# EAGLE design RPBv2 (EAGLE 6.5.0)

## Sheet 1 of 3
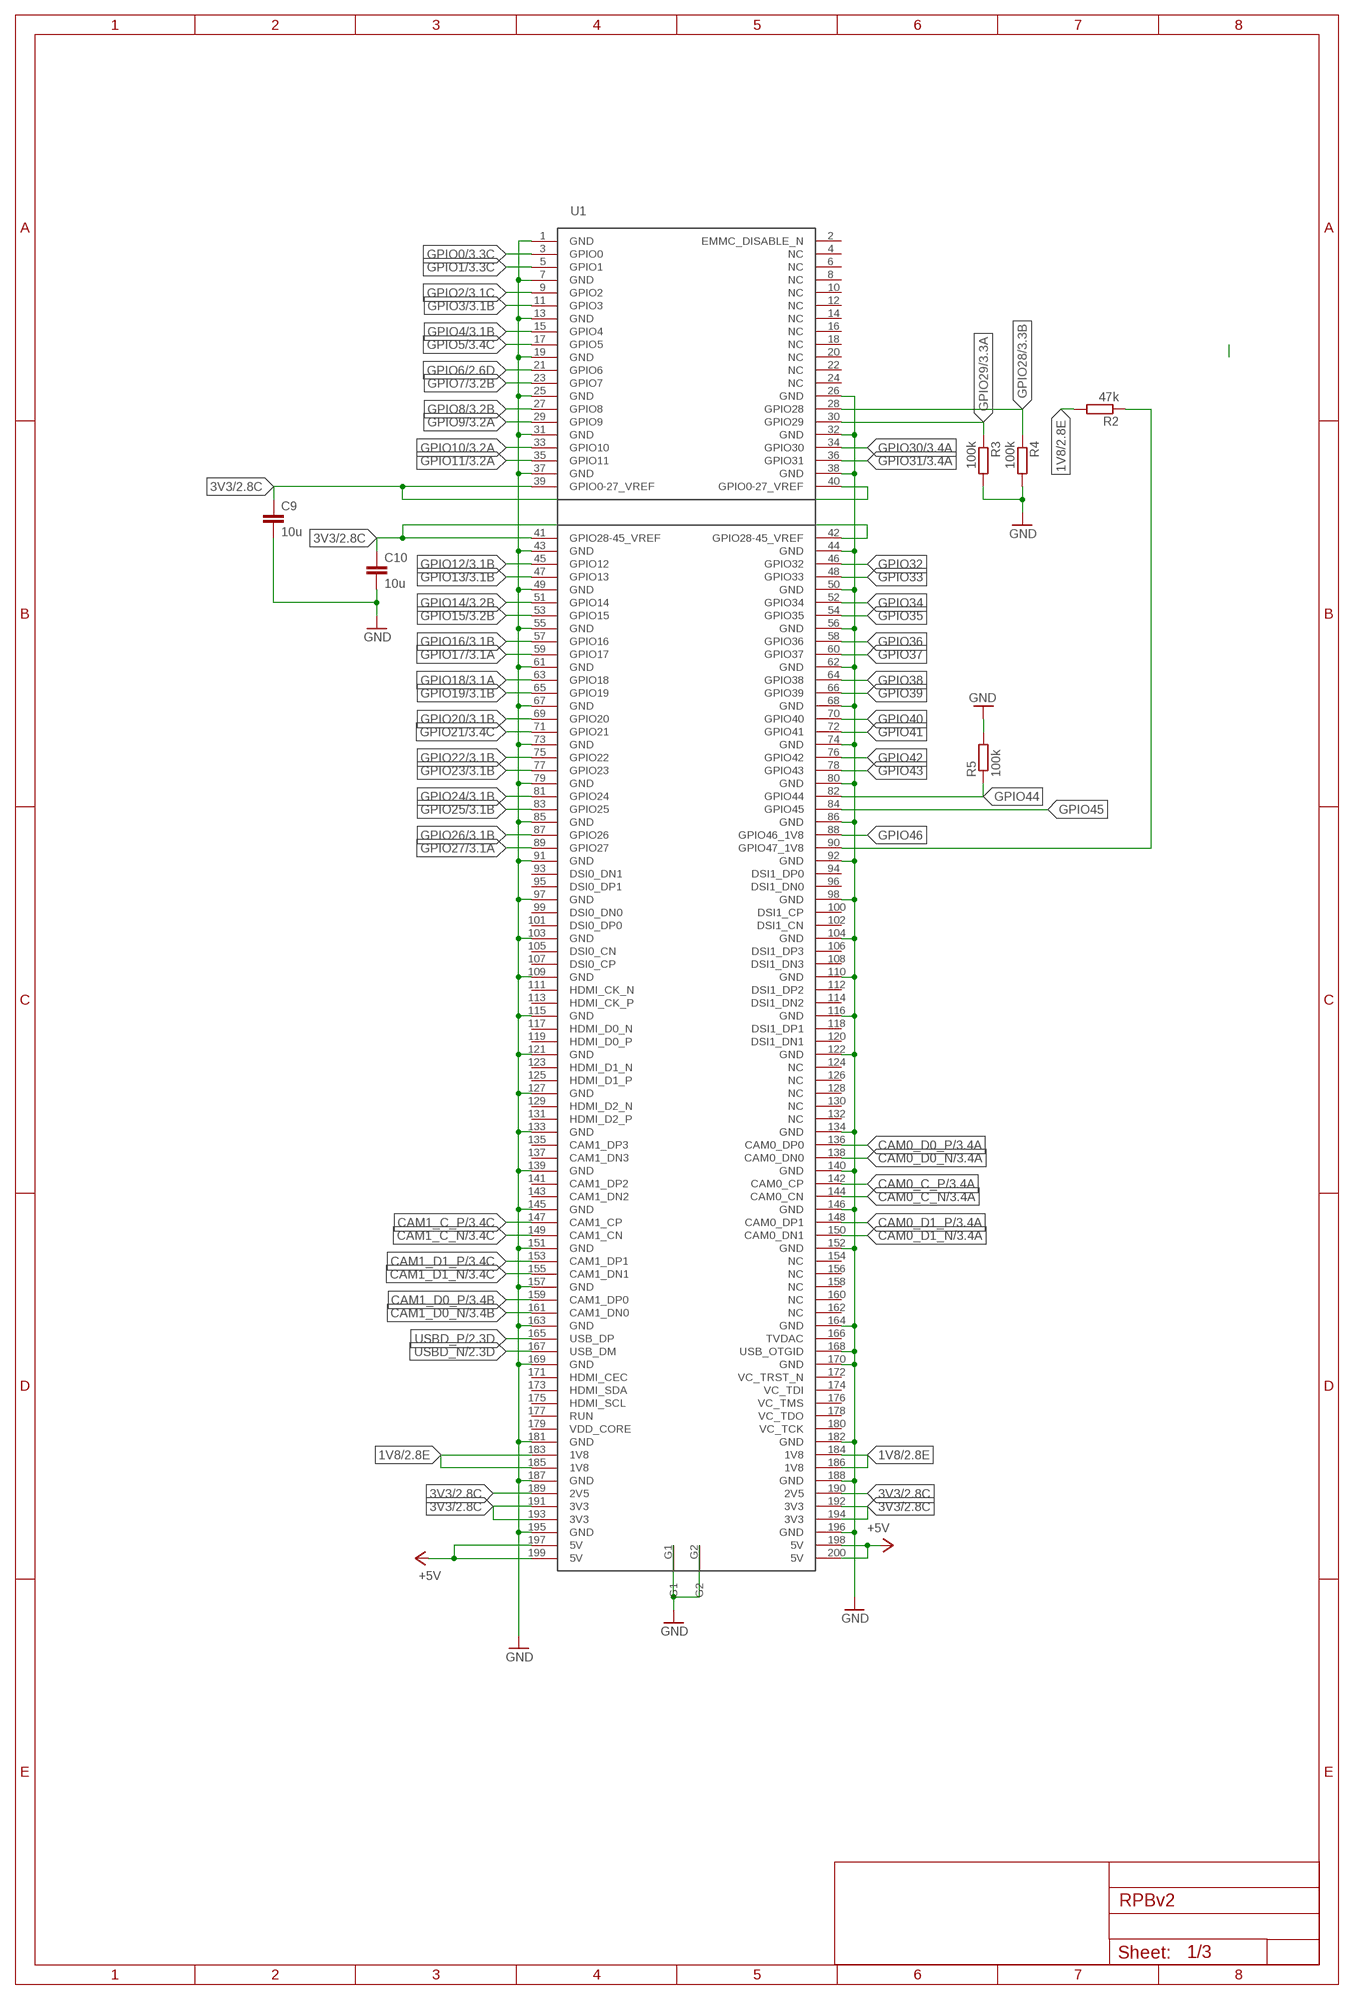
[diagram p0: schematic, sheet 1]

### Parts
C9  10u  C-EUC0805  [C0805]
C10  10u  C-EUC0805  [C0805]
R2  47k  R-EU_R0603  [R0603]
R3  100k  R-EU_R0603  [R0603]
R4  100k  R-EU_R0603  [R0603]
R5  100k  R-EU_R0603  [R0603]
U1  RASPI  [SO-DIMM]

### Nets
1V8: R2.2 U1.183(1V8) U1.184(1V8) U1.185(1V8) U1.186(1V8) ; also sheet 2
3V3: C9.1 C10.1 U1.39(GPIO0-27_VREF) U1.40(GPIO0-27_VREF) U1.41(GPIO28-45_VREF) U1.42(GPIO28-45_VREF) U1.189(2V5) U1.190(2V5) U1.191(3V3) U1.192(3V3) U1.193(3V3) U1.194(3V3) ; also sheet 2,3
+5V: U1.197(5V) U1.198(5V) U1.199(5V) U1.200(5V) ; also sheet 2,3
CAM0_C_N: U1.144(CAM0_CN) ; also sheet 3
CAM0_C_P: U1.142(CAM0_CP) ; also sheet 3
CAM0_D0_N: U1.138(CAM0_DN0) ; also sheet 3
CAM0_D0_P: U1.136(CAM0_DP0) ; also sheet 3
CAM0_D1_N: U1.150(CAM0_DN1) ; also sheet 3
CAM0_D1_P: U1.148(CAM0_DP1) ; also sheet 3
CAM1_C_N: U1.149(CAM1_CN) ; also sheet 3
CAM1_C_P: U1.147(CAM1_CP) ; also sheet 3
CAM1_D0_N: U1.161(CAM1_DN0) ; also sheet 3
CAM1_D0_P: U1.159(CAM1_DP0) ; also sheet 3
CAM1_D1_N: U1.155(CAM1_DN1) ; also sheet 3
CAM1_D1_P: U1.153(CAM1_DP1) ; also sheet 3
GND: C9.2 C10.2 R3.2 R4.2 R5.2 U1.1(GND) U1.7(GND) U1.13(GND) U1.19(GND) U1.25(GND) U1.26(GND) U1.31(GND) U1.32(GND) U1.37(GND) U1.38(GND) U1.43(GND) U1.44(GND) U1.49(GND) U1.50(GND) U1.55(GND) U1.56(GND) U1.61(GND) U1.62(GND) U1.67(GND) U1.68(GND) U1.73(GND) U1.74(GND) U1.79(GND) U1.80(GND) U1.85(GND) U1.86(GND) U1.91(GND) U1.92(GND) U1.97(GND) U1.98(GND) U1.103(GND) U1.104(GND) U1.109(GND) U1.110(GND) U1.115(GND) U1.116(GND) U1.121(GND) U1.122(GND) U1.127(GND) U1.133(GND) U1.134(GND) U1.139(GND) U1.140(GND) U1.145(GND) U1.146(GND) U1.151(GND) U1.152(GND) U1.157(GND) U1.163(GND) U1.164(GND) U1.168(USB_OTGID) U1.169(GND) U1.170(GND) U1.181(GND) U1.182(GND) U1.187(GND) U1.188(GND) U1.195(GND) U1.196(GND) U1.G1 U1.G2 ; also sheet 2,3
GPIO0: U1.3(GPIO0) ; also sheet 3
GPIO1: U1.5(GPIO1) ; also sheet 3
GPIO2: U1.9(GPIO2) ; also sheet 3
GPIO3: U1.11(GPIO3) ; also sheet 3
GPIO4: U1.15(GPIO4) ; also sheet 3
GPIO5: U1.17(GPIO5) ; also sheet 3
GPIO6: U1.21(GPIO6) ; also sheet 2,3
GPIO7: U1.23(GPIO7) ; also sheet 3
GPIO8: U1.27(GPIO8) ; also sheet 3
GPIO9: U1.29(GPIO9) ; also sheet 3
GPIO10: U1.33(GPIO10) ; also sheet 3
GPIO11: U1.35(GPIO11) ; also sheet 3
GPIO12: U1.45(GPIO12) ; also sheet 3
GPIO13: U1.47(GPIO13) ; also sheet 3
GPIO14: U1.51(GPIO14) ; also sheet 3
GPIO15: U1.53(GPIO15) ; also sheet 3
GPIO16: U1.57(GPIO16) ; also sheet 3
GPIO17: U1.59(GPIO17) ; also sheet 3
GPIO18: U1.63(GPIO18) ; also sheet 3
GPIO19: U1.65(GPIO19) ; also sheet 3
GPIO20: U1.69(GPIO20) ; also sheet 3
GPIO21: U1.71(GPIO21) ; also sheet 3
GPIO22: U1.75(GPIO22) ; also sheet 3
GPIO23: U1.77(GPIO23) ; also sheet 3
GPIO24: U1.81(GPIO24) ; also sheet 3
GPIO25: U1.83(GPIO25) ; also sheet 3
GPIO26: U1.87(GPIO26) ; also sheet 3
GPIO27: U1.89(GPIO27) ; also sheet 3
GPIO28: R4.1 U1.28(GPIO28) ; also sheet 3
GPIO29: R3.1 U1.30(GPIO29) ; also sheet 3
GPIO30: U1.34(GPIO30) ; also sheet 3
GPIO31: U1.36(GPIO31) ; also sheet 3
GPIO32: U1.46(GPIO32)
GPIO33: U1.48(GPIO33)
GPIO34: U1.52(GPIO34)
GPIO35: U1.54(GPIO35)
GPIO36: U1.58(GPIO36)
GPIO37: U1.60(GPIO37)
GPIO38: U1.64(GPIO38)
GPIO39: U1.66(GPIO39)
GPIO40: U1.70(GPIO40)
GPIO41: U1.72(GPIO41)
GPIO42: U1.76(GPIO42)
GPIO43: U1.78(GPIO43)
GPIO44: R5.1 U1.82(GPIO44)
GPIO45: U1.84(GPIO45)
GPIO46: U1.88(GPIO46_1V8)
N$6: R2.1 U1.90(GPIO47_1V8)
USBD_N: U1.167(USB_DM) ; also sheet 2
USBD_P: U1.165(USB_DP) ; also sheet 2
Unconnected: U1.2(EMMC_DISABLE_N) U1.4(NC) U1.6(NC) U1.8(NC) U1.10(NC) U1.12(NC) U1.14(NC) U1.16(NC) U1.18(NC) U1.20(NC) U1.22(NC) U1.24(NC) U1.93(DSI0_DN1) U1.94(DSI1_DP0) U1.95(DSI0_DP1) U1.96(DSI1_DN0) U1.99(DSI0_DN0) U1.100(DSI1_CP) U1.101(DSI0_DP0) U1.102(DSI1_CN) U1.105(DSI0_CN) U1.106(DSI1_DP3) U1.107(DSI0_CP) U1.108(DSI1_DN3) U1.111(HDMI_CK_N) U1.112(DSI1_DP2) U1.113(HDMI_CK_P) U1.114(DSI1_DN2) U1.117(HDMI_D0_N) U1.118(DSI1_DP1) U1.119(HDMI_D0_P) U1.120(DSI1_DN1) U1.123(HDMI_D1_N) U1.124(NC) U1.125(HDMI_D1_P) U1.126(NC) U1.128(NC) U1.129(HDMI_D2_N) U1.130(NC) U1.131(HDMI_D2_P) U1.132(NC) U1.135(CAM1_DP3) U1.137(CAM1_DN3) U1.141(CAM1_DP2) U1.143(CAM1_DN2) U1.154(NC) U1.156(NC) U1.158(NC) U1.160(NC) U1.162(NC) U1.166(TVDAC) U1.171(HDMI_CEC) U1.172(VC_TRST_N) U1.173(HDMI_SDA) U1.174(VC_TDI) U1.175(HDMI_SCL) U1.176(VC_TMS) U1.177(RUN) U1.178(VC_TDO) U1.179(VDD_CORE) U1.180(VC_TCK)

## Sheet 2 of 3
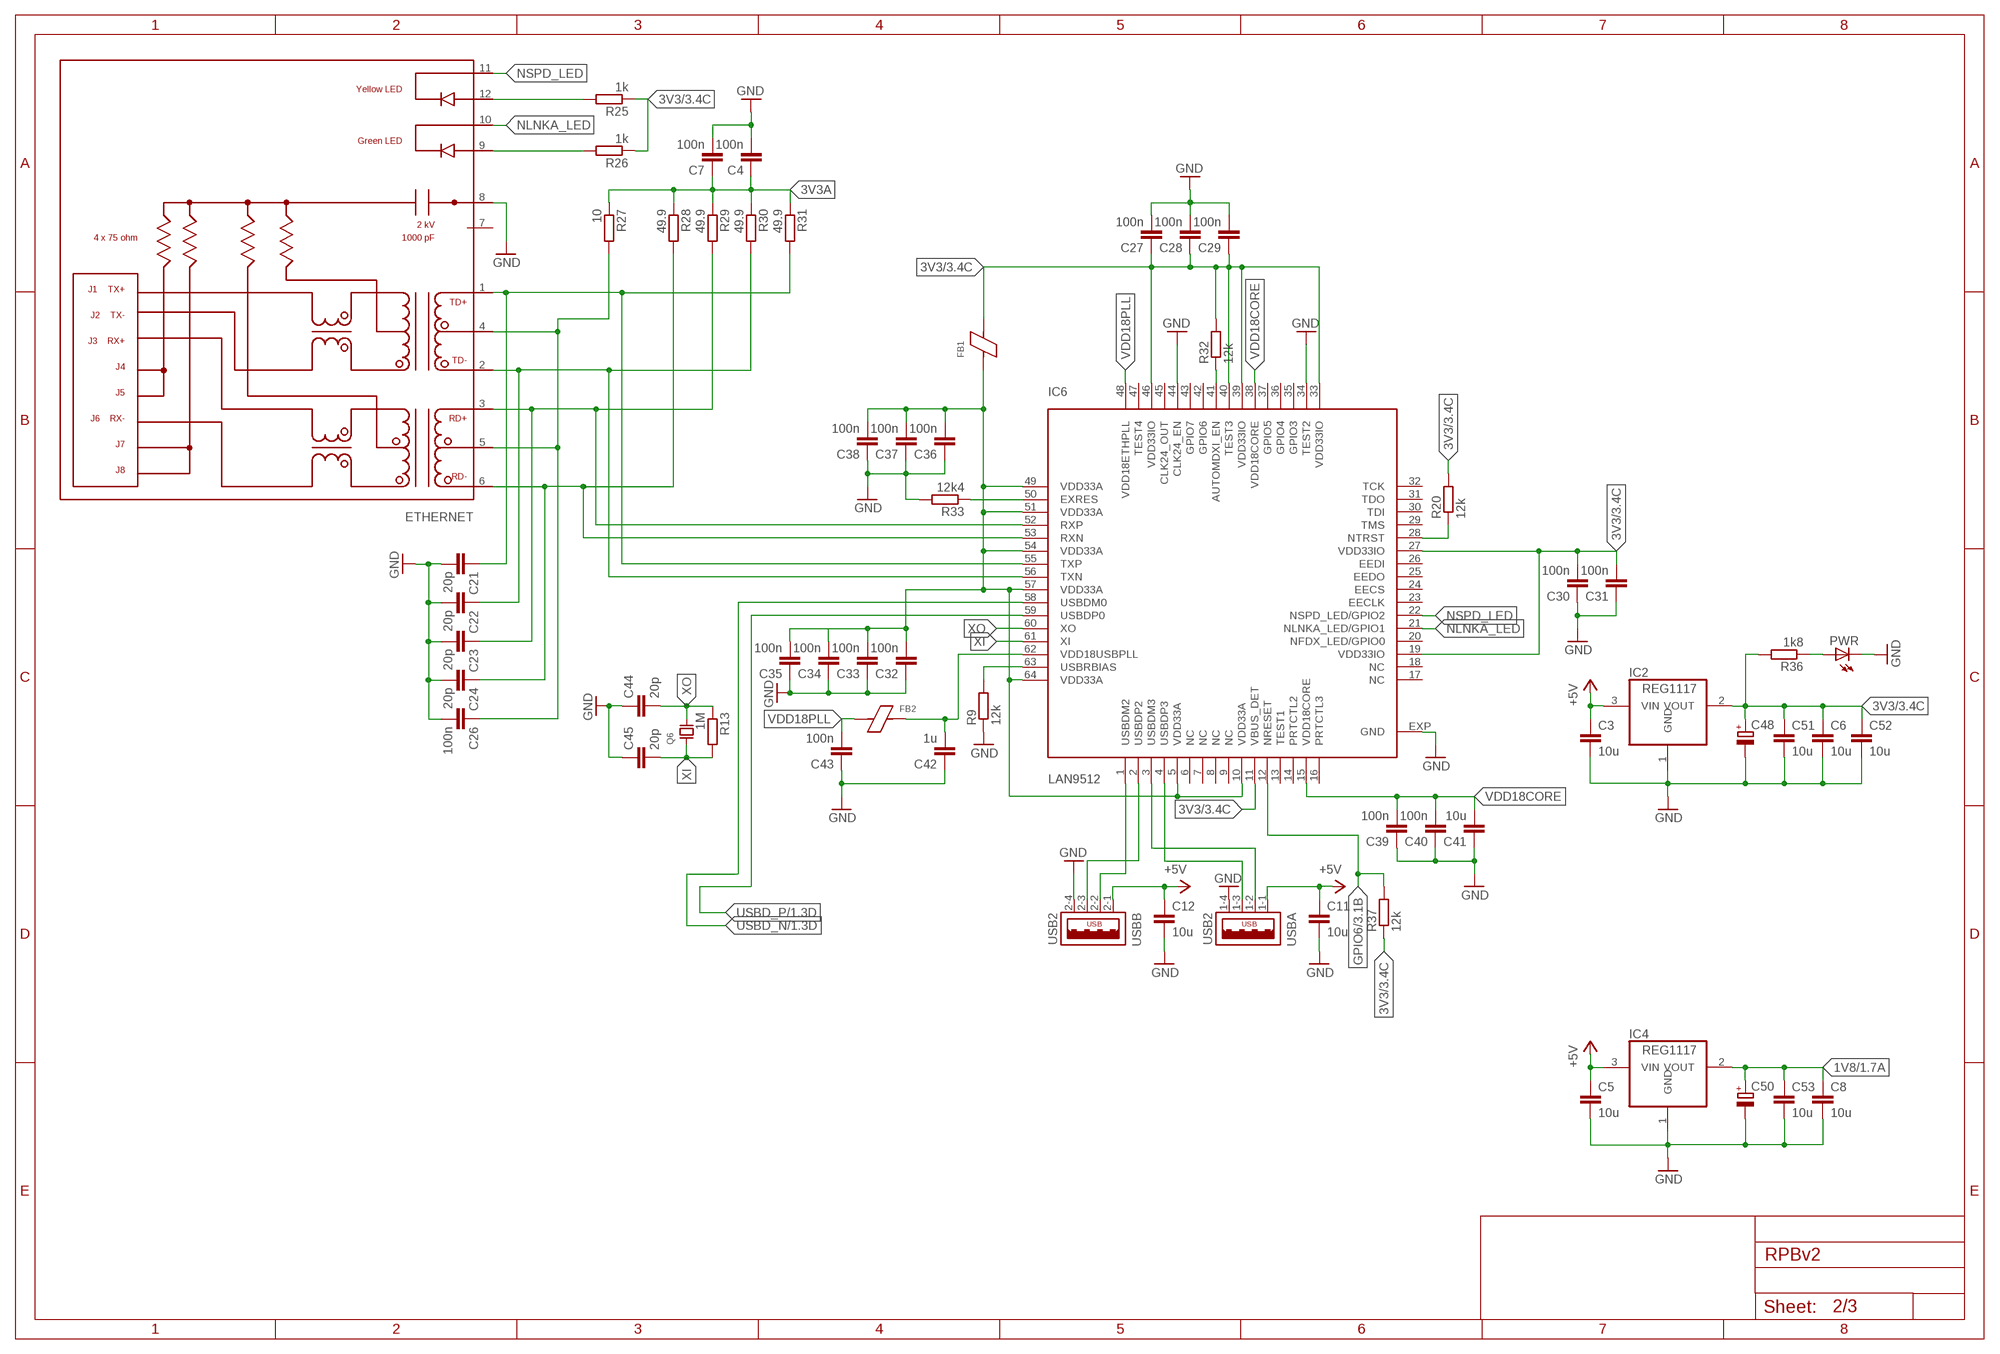
[diagram p1: schematic, sheet 2]

### Parts
C3  10u  C-EUC0805  [C0805]
C4  100n  C-EUC0603  [C0603]
C5  10u  C-EUC0805  [C0805]
C6  10u  C-EUC0805  [C0805]
C7  100n  C-EUC0603  [C0603]
C8  10u  C-EUC0805  [C0805]
C11  10u  C-EUC0805  [C0805]
C12  10u  C-EUC0805  [C0805]
C21  20p  C-EUC0603  [C0603]
C22  20p  C-EUC0603  [C0603]
C23  20p  C-EUC0603  [C0603]
C24  20p  C-EUC0603  [C0603]
C26  100n  C-EUC0603  [C0603]
C27  100n  C-EUC0603  [C0603]
C28  100n  C-EUC0603  [C0603]
C29  100n  C-EUC0603  [C0603]
C30  100n  C-EUC0603  [C0603]
C31  100n  C-EUC0603  [C0603]
C32  100n  C-EUC0603  [C0603]
C33  100n  C-EUC0603  [C0603]
C34  100n  C-EUC0603  [C0603]
C35  100n  C-EUC0603  [C0603]
C36  100n  C-EUC0603  [C0603]
C37  100n  C-EUC0603  [C0603]
C38  100n  C-EUC0603  [C0603]
C39  100n  C-EUC0603  [C0603]
C40  100n  C-EUC0603  [C0603]
C41  10u  C-EUC0805  [C0805]
C42  1u  C-EUC0805  [C0805]
C43  100n  C-EUC0603  [C0603]
C44  20p  C-EUC0603  [C0603]
C45  20p  C-EUC0603  [C0603]
C48  CPOL-EU153CLV-0605  [153CLV-0605]
C50  CPOL-EU153CLV-0605  [153CLV-0605]
C51  10u  C-EUC0805  [C0805]
C52  10u  C-EUC0805  [C0805]
C53  10u  C-EUC0805  [C0805]
ETHERNET  HR911105A  [RJ45]
FB1  FERRITE_BEAD  [C0805]
FB2  FERRITE_BEAD  [C0805]
IC2  REG1117  [SOT223]
IC4  REG1117  [SOT223]
IC6  LAN9512  [QFN64-9X9]
PWR  LEDCHIP-LED0603  [CHIP-LED0603]
Q6  CTS_32X25_SMD  [CTS_32X25]
R9  12k  R-EU_R0603  [R0603]
R13  1M  R-EU_R0603  [R0603]
R20  12k  R-EU_R0603  [R0603]
R25  1k  R-EU_R0603  [R0603]
R26  1k  R-EU_R0603  [R0603]
R27  10  R-EU_R0603  [R0603]
R28  49.9  R-EU_R0603  [R0603]
R29  49.9  R-EU_R0603  [R0603]
R30  49.9  R-EU_R0603  [R0603]
R31  49.9  R-EU_R0603  [R0603]
R32  12k  R-EU_R0603  [R0603]
R33  12k4  R-EU_R0603  [R0603]
R36  1k8  R-EU_R0603  [R0603]
R37  12k  R-EU_R0603  [R0603]
USB  USB2  [USB2]

### Nets
1V8: C8.1 C50.+ C53.1 IC4.2(VOUT) ; also sheet 1
3V3: C6.1 C27.1 C28.1 C29.1 C30.2 C31.2 C48.+ C51.1 C52.1 FB1.2 IC2.2(VOUT) IC6.11(VBUS_DET) IC6.19(VDD33IO) IC6.27(VDD33IO) IC6.33(VDD33IO) IC6.39(VDD33IO) IC6.40(TEST3) IC6.46(VDD33IO) R20.2 R25.1 R26.1 R32.2 R36.2 R37.1 ; also sheet 1,3
3V3A: C4.1 C7.1 C32.2 C33.2 C34.2 C35.2 C36.2 C37.2 C38.2 FB1.1 IC6.5(VDD33A) IC6.10(VDD33A) IC6.49(VDD33A) IC6.51(VDD33A) IC6.54(VDD33A) IC6.57(VDD33A) IC6.64(VDD33A) R27.1 R28.1 R29.1 R30.1 R31.1
+5V: C3.1 C5.1 C11.1 C12.1 IC2.3(VIN) IC4.3(VIN) USB.1-1 USB.2-1 ; also sheet 1,3
GND: C3.2 C4.2 C5.2 C6.2 C7.2 C8.2 C11.2 C12.2 C21.2 C22.2 C23.2 C24.2 C26.2 C27.2 C28.2 C29.2 C30.1 C31.1 C32.1 C33.1 C34.1 C35.1 C36.1 C37.1 C38.1 C39.1 C40.1 C41.1 C42.1 C43.1 C44.1 C45.1 C48.- C50.- C51.2 C52.2 C53.2 ETHERNET.8 IC2.1(GND) IC4.1(GND) IC6.34(TEST2) IC6.44(CLK24_EN) IC6.EXP(GND) PWR.C R9.1 R33.2 USB.1-4 USB.2-4 ; also sheet 1,3
GPIO6: IC6.12(NRESET) R37.2 ; also sheet 1,3
N$1: PWR.A R36.1
N$7: ETHERNET.12 R25.2
N$8: ETHERNET.9 R26.2
N$9: IC6.28(NTRST) R20.1
N$11: IC6.63(USBRBIAS) R9.2
N$17: C26.1 ETHERNET.4 ETHERNET.5 R27.2
N$40: C42.2 FB2.2 IC6.62(VDD18USBPLL)
N$42: IC6.41(AUTOMDXI_EN) R32.1
N$43: IC6.50(EXRES) R33.1
NLNKA_LED: ETHERNET.10 IC6.21(NLNKA_LED/GPIO1)
NSPD_LED: ETHERNET.11 IC6.22(NSPD_LED/GPIO2)
RX_N: C24.1 ETHERNET.6 IC6.53(RXN) R28.2
RX_P: C23.1 ETHERNET.3 IC6.52(RXP) R29.2
TX_N: C22.1 ETHERNET.2 IC6.56(TXN) R30.2
TX_P: C21.1 ETHERNET.1 IC6.55(TXP) R31.2
USBD2_N: IC6.1(USBDM2) USB.2-2
USBD2_P: IC6.2(USBDP2) USB.2-3
USBD3_N: IC6.3(USBDM3) USB.1-2
USBD3_P: IC6.4(USBDP3) USB.1-3
USBD_N: IC6.58(USBDM0) ; also sheet 1
USBD_P: IC6.59(USBDP0) ; also sheet 1
VDD18CORE: C39.2 C40.2 C41.2 IC6.15(VDD18CORE) IC6.38(VDD18CORE)
VDD18PLL: C43.2 FB2.1 IC6.48(VDD18ETHPLL)
XI: C45.2 IC6.61(XI) Q6.1(X1) R13.2
XO: C44.2 IC6.60(XO) Q6.3(X2) R13.1
Unconnected: ETHERNET.7 IC6.6(NC) IC6.7(NC) IC6.8(NC) IC6.9(NC) IC6.13(TEST1) IC6.14(PRTCTL2) IC6.16(PRTCTL3) IC6.17(NC) IC6.18(NC) IC6.20(NFDX_LED/GPIO0) IC6.23(EECLK) IC6.24(EECS) IC6.25(EEDO) IC6.26(EEDI) IC6.29(TMS) IC6.30(TDI) IC6.31(TDO) IC6.32(TCK) IC6.35(GPIO3) IC6.36(GPIO4) IC6.37(GPIO5) IC6.42(GPIO6) IC6.43(GPIO7) IC6.45(CLK24_OUT) IC6.47(TEST4) USB.M1(S:S1) USB.M2(S:S2) USB.M3(S:S3) USB.M4(S:S4)

## Sheet 3 of 3
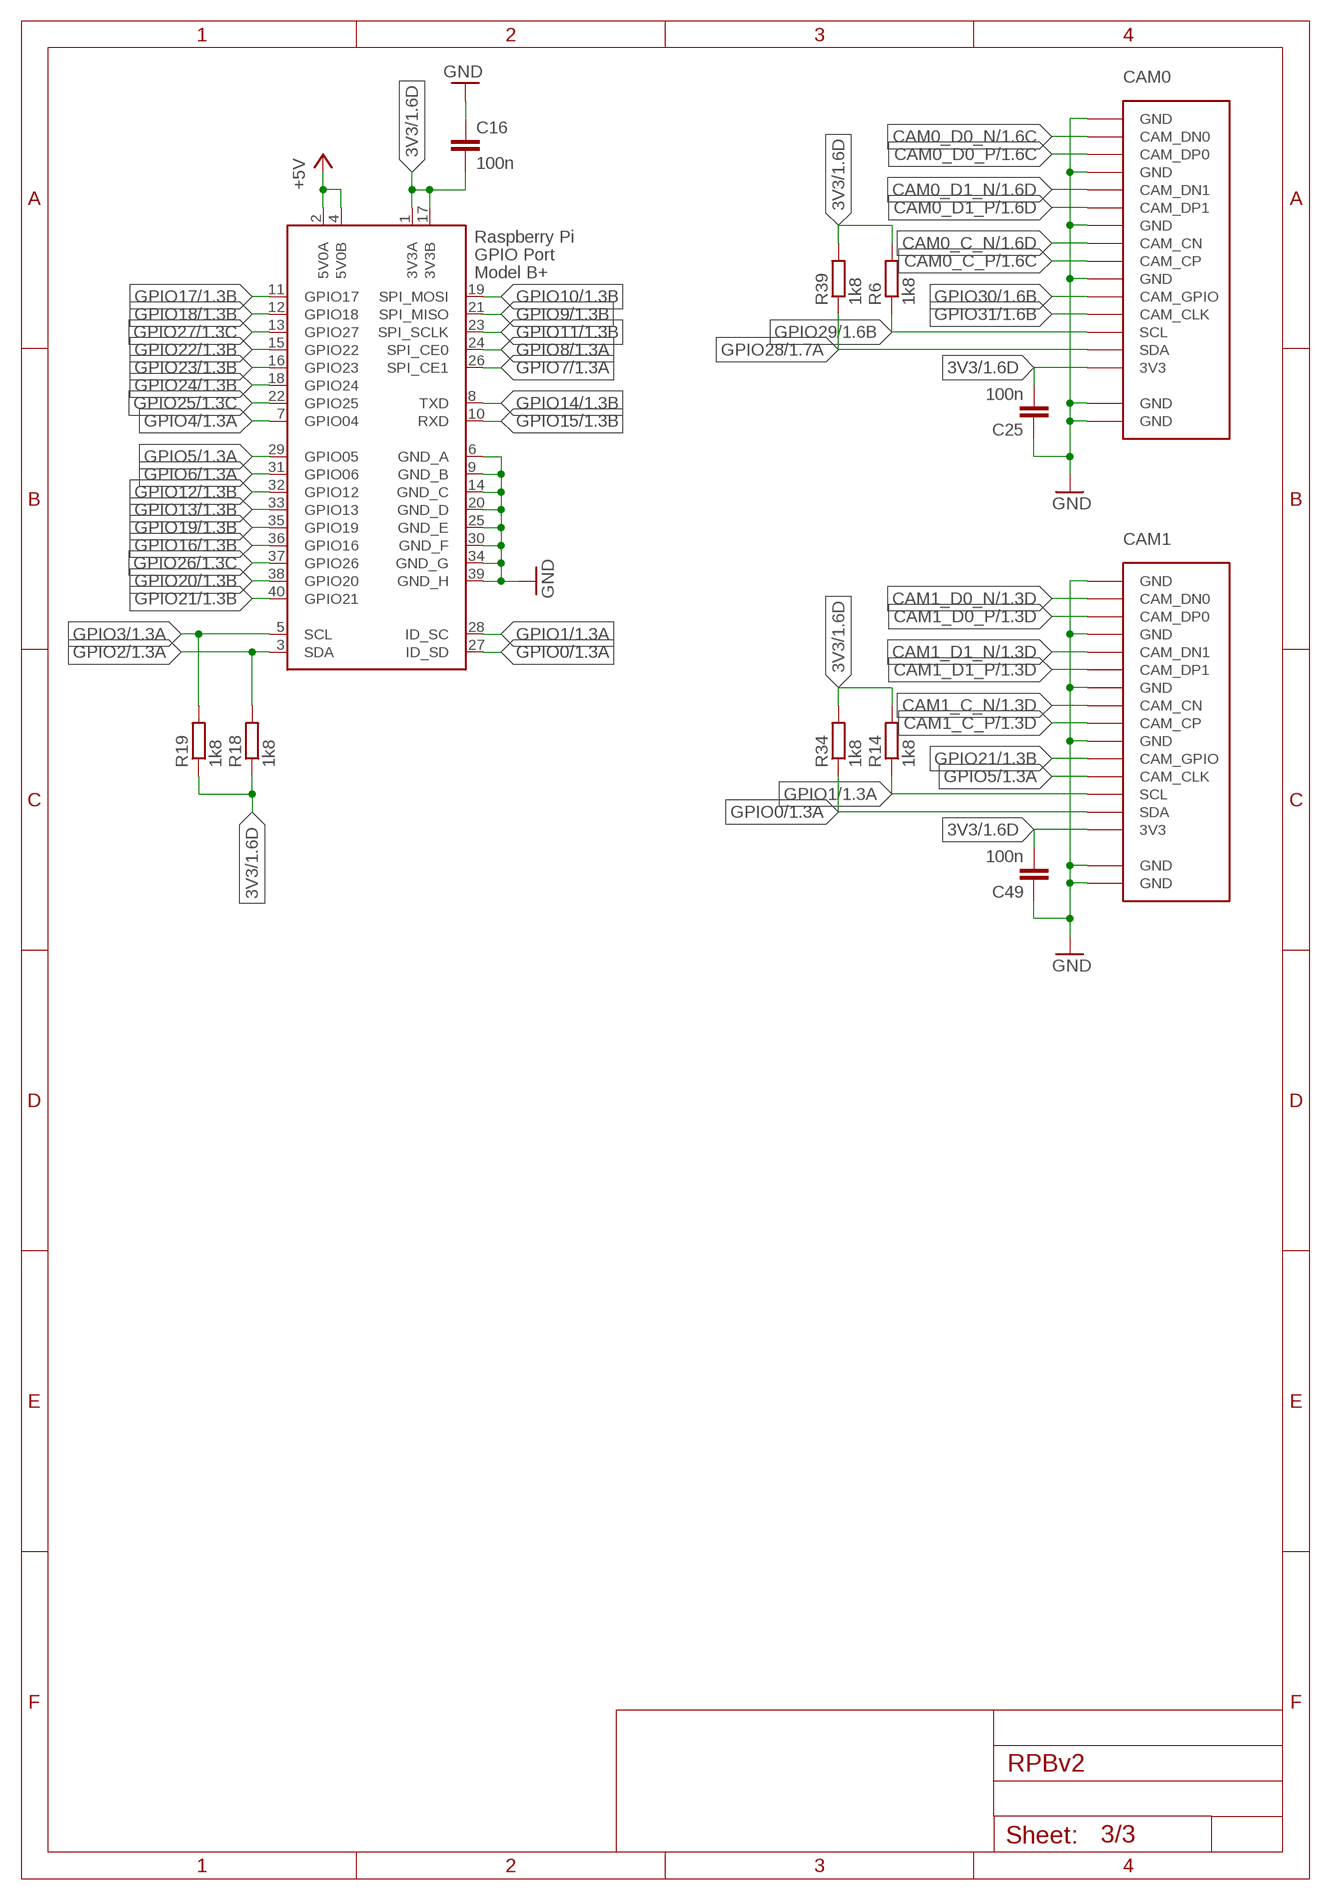
[diagram p2: schematic, sheet 3]

### Parts
C16  100n  C-EUC0603  [C0603]
C25  100n  C-EUC0603  [C0603]
C49  100n  C-EUC0603  [C0603]
CAM0  FFC-15  [FFC-15]
CAM1  RASPI_CAM  [FFC-15]
GPIO  PITFT_  [RASPI_GPIO_B+_PIN]
R6  1k8  R-EU_R0603  [R0603]
R14  1k8  R-EU_R0603  [R0603]
R18  1k8  R-EU_R0603  [R0603]
R19  1k8  R-EU_R0603  [R0603]
R34  1k8  R-EU_R0603  [R0603]
R39  1k8  R-EU_R0603  [R0603]

### Nets
3V3: C16.2 C25.2 C49.2 CAM0.P$15(3V3) CAM1.P$15(3V3) GPIO.1(3V3A) GPIO.17(3V3B) R6.2 R14.2 R18.1 R19.1 R34.2 R39.2 ; also sheet 1,2
+5V: GPIO.2(5V0A) GPIO.4(5V0B) ; also sheet 1,2
CAM0_C_N: CAM0.P$8(CAM_CN) ; also sheet 1
CAM0_C_P: CAM0.P$9(CAM_CP) ; also sheet 1
CAM0_D0_N: CAM0.P$2(CAM_DN0) ; also sheet 1
CAM0_D0_P: CAM0.P$3(CAM_DP0) ; also sheet 1
CAM0_D1_N: CAM0.P$5(CAM_DN1) ; also sheet 1
CAM0_D1_P: CAM0.P$6(CAM_DP1) ; also sheet 1
CAM1_C_N: CAM1.P$8(CAM_CN) ; also sheet 1
CAM1_C_P: CAM1.P$9(CAM_CP) ; also sheet 1
CAM1_D0_N: CAM1.P$2(CAM_DN0) ; also sheet 1
CAM1_D0_P: CAM1.P$3(CAM_DP0) ; also sheet 1
CAM1_D1_N: CAM1.P$5(CAM_DN1) ; also sheet 1
CAM1_D1_P: CAM1.P$6(CAM_DP1) ; also sheet 1
GND: C16.1 C25.1 C49.1 CAM0.P$1(GND) CAM0.P$4(GND) CAM0.P$7(GND) CAM0.P$10(GND) CAM0.P$16(GND) CAM0.P$17(GND) CAM1.P$1(GND) CAM1.P$4(GND) CAM1.P$7(GND) CAM1.P$10(GND) CAM1.P$16(GND) CAM1.P$17(GND) GPIO.6(GND_A) GPIO.9(GND_B) GPIO.14(GND_C) GPIO.20(GND_D) GPIO.25(GND_E) GPIO.30(GND_F) GPIO.34(GND_G) GPIO.39(GND_H) ; also sheet 1,2
GPIO0: CAM1.P$14(SDA) GPIO.27(ID_SD) R34.1 ; also sheet 1
GPIO1: CAM1.P$13(SCL) GPIO.28(ID_SC) R14.1 ; also sheet 1
GPIO2: GPIO.3(SDA) R18.2 ; also sheet 1
GPIO3: GPIO.5(SCL) R19.2 ; also sheet 1
GPIO4: GPIO.7(GPIO04) ; also sheet 1
GPIO5: CAM1.P$12(CAM_CLK) GPIO.29(GPIO05) ; also sheet 1
GPIO6: GPIO.31(GPIO06) ; also sheet 1,2
GPIO7: GPIO.26(SPI_CE1) ; also sheet 1
GPIO8: GPIO.24(SPI_CE0) ; also sheet 1
GPIO9: GPIO.21(SPI_MISO) ; also sheet 1
GPIO10: GPIO.19(SPI_MOSI) ; also sheet 1
GPIO11: GPIO.23(SPI_SCLK) ; also sheet 1
GPIO12: GPIO.32(GPIO12) ; also sheet 1
GPIO13: GPIO.33(GPIO13) ; also sheet 1
GPIO14: GPIO.8(TXD) ; also sheet 1
GPIO15: GPIO.10(RXD) ; also sheet 1
GPIO16: GPIO.36(GPIO16) ; also sheet 1
GPIO17: GPIO.11(GPIO17) ; also sheet 1
GPIO18: GPIO.12(GPIO18) ; also sheet 1
GPIO19: GPIO.35(GPIO19) ; also sheet 1
GPIO20: GPIO.38(GPIO20) ; also sheet 1
GPIO21: CAM1.P$11(CAM_GPIO) GPIO.40(GPIO21) ; also sheet 1
GPIO22: GPIO.15(GPIO22) ; also sheet 1
GPIO23: GPIO.16(GPIO23) ; also sheet 1
GPIO24: GPIO.18(GPIO24) ; also sheet 1
GPIO25: GPIO.22(GPIO25) ; also sheet 1
GPIO26: GPIO.37(GPIO26) ; also sheet 1
GPIO27: GPIO.13(GPIO27) ; also sheet 1
GPIO28: CAM0.P$14(SDA) R39.1 ; also sheet 1
GPIO29: CAM0.P$13(SCL) R6.1 ; also sheet 1
GPIO30: CAM0.P$11(CAM_GPIO) ; also sheet 1
GPIO31: CAM0.P$12(CAM_CLK) ; also sheet 1

## Library data of the parts
C3-C12 C16 C21-C45 C49 C51-C53 = rcl:C-EU: CAPACITOR, European symbol
C48 C50 = rcl:CPOL-EU: POLARIZED CAPACITOR, European symbol
CAM0 = raspi:FFC-15
CAM1 = raspi:RASPI_CAM
ETHERNET = hanrun:HR911105A: Low cost RJ45 connector with integrated magnetics and LEDs. www.hasseb.fi
FB1 FB2 = raspi:FERRITE_BEAD
GPIO = raspi:PITFT: 2x20 header connector, all pins connected
IC2 IC4 = burr-brown:REG1117: 800mA and 1A Low Dropout (LDO) Positive Regulator 1.8V, 2.5V, 2.85V, 3.3V, 5V, and Adj; MPN: REG1117; OC_FARNELL: 1097566; OC_NEWARK: 14P6981
IC6 = raspi:LAN9512
PWR = led:LED: LED OSRAM: - CHIPLED LG R971, LG N971, LY N971, LG Q971, LY Q971, LO R971, LY R971 LH N974, LH R974 LS Q976, LO Q976, LY Q976 LO Q996 - Hyper CHIPLED LW Q18S LB Q993, LB Q99A, LB R99A - SideLED LS A670, LO A670, LY A670, LG A670, LP A670 LB A673, LV A673, LT A673, LW A673 LH A674 LY A675 LS A676, LA A676, LO A676, LY A676, LW A676 LS A679, LY A679, LG A679 - Hyper Micro SIDELED® LS Y876, LA Y876, LO Y876, LY Y876 LT Y87S - SmartLED LW L88C, LW L88S LB L89C, LB L89S, LG L890 LS L89K, LO L89K, LY L89K LS L896, LA L896, LO L896, LY L896 - TOPLED LS T670, LO T670, LY T670, LG T670, LP T670 LSG T670, LSP T670, LSY T670, LOP T670, LYG T670 LG T671, LOG T671, LSG T671 LB T673, LV T673, LT T673, LW T673 LH T674 LS T676, LA T676, LO T676, LY T676, LB T676, LH T676, LSB T676, LW T676 LB T67C, LV T67C, LT T67C, LS T67K, LO T67K, LY T67K, LW E67C LS E67B, LA E67B, LO E67B, LY E67B, LB E67C, LV E67C, LT E67C LW T67C LS T679, LY T679, LG T679 LS T770, LO T770, LY T770, LG T770, LP T770 LB T773, LV T773, LT T773, LW T773 LH T774 LS E675, LA E675, LY E675, LS T675 LS T776, LA T776, LO T776, LY T776, LB T776 LHGB T686 LT T68C, LB T68C - Hyper Mini TOPLED® LB M676 - Mini TOPLED Santana® LG M470 LS M47K, LO M47K, LY M47K Source: http://www.osram.convergy.de LUXEON: - LUMILED® LXK2-PW12-R00, LXK2-PW12-S00, LXK2-PW14-U00, LXK2-PW14-V00 LXK2-PM12-R00, LXK2-PM12-S00, LXK2-PM14-U00 LXK2-PE12-Q00, LXK2-PE12-R00, LXK2-PE12-S00, LXK2-PE14-T00, LXK2-PE14-U00 LXK2-PB12-K00, LXK2-PB12-L00, LXK2-PB12-M00, LXK2-PB14-N00, LXK2-PB14-P00, LXK2-PB14-Q00 LXK2-PR12-L00, LXK2-PR12-M00, LXK2-PR14-Q00, LXK2-PR14-R00 LXK2-PD12-Q00, LXK2-PD12-R00, LXK2-PD12-S00 LXK2-PH12-R00, LXK2-PH12-S00 LXK2-PL12-P00, LXK2-PL12-Q00, LXK2-PL12-R00 Source: www.luxeon.com KINGBRIGHT: KA-3528ASYC Source: www.kingbright.com
Q6 = raspi:CTS_32X25_SMD
R2-R6 R9 R13 R14 R18-R20 R25-R34 R36 R37 R39 = rcl:R-EU_: RESISTOR, European symbol
U1 = raspi:RASPI
USB = raspi:USB2: Triple USB Connector Source: www.cypressindustries.com; OC_FARNELL: unknown; OC_NEWARK: unknown

## Board
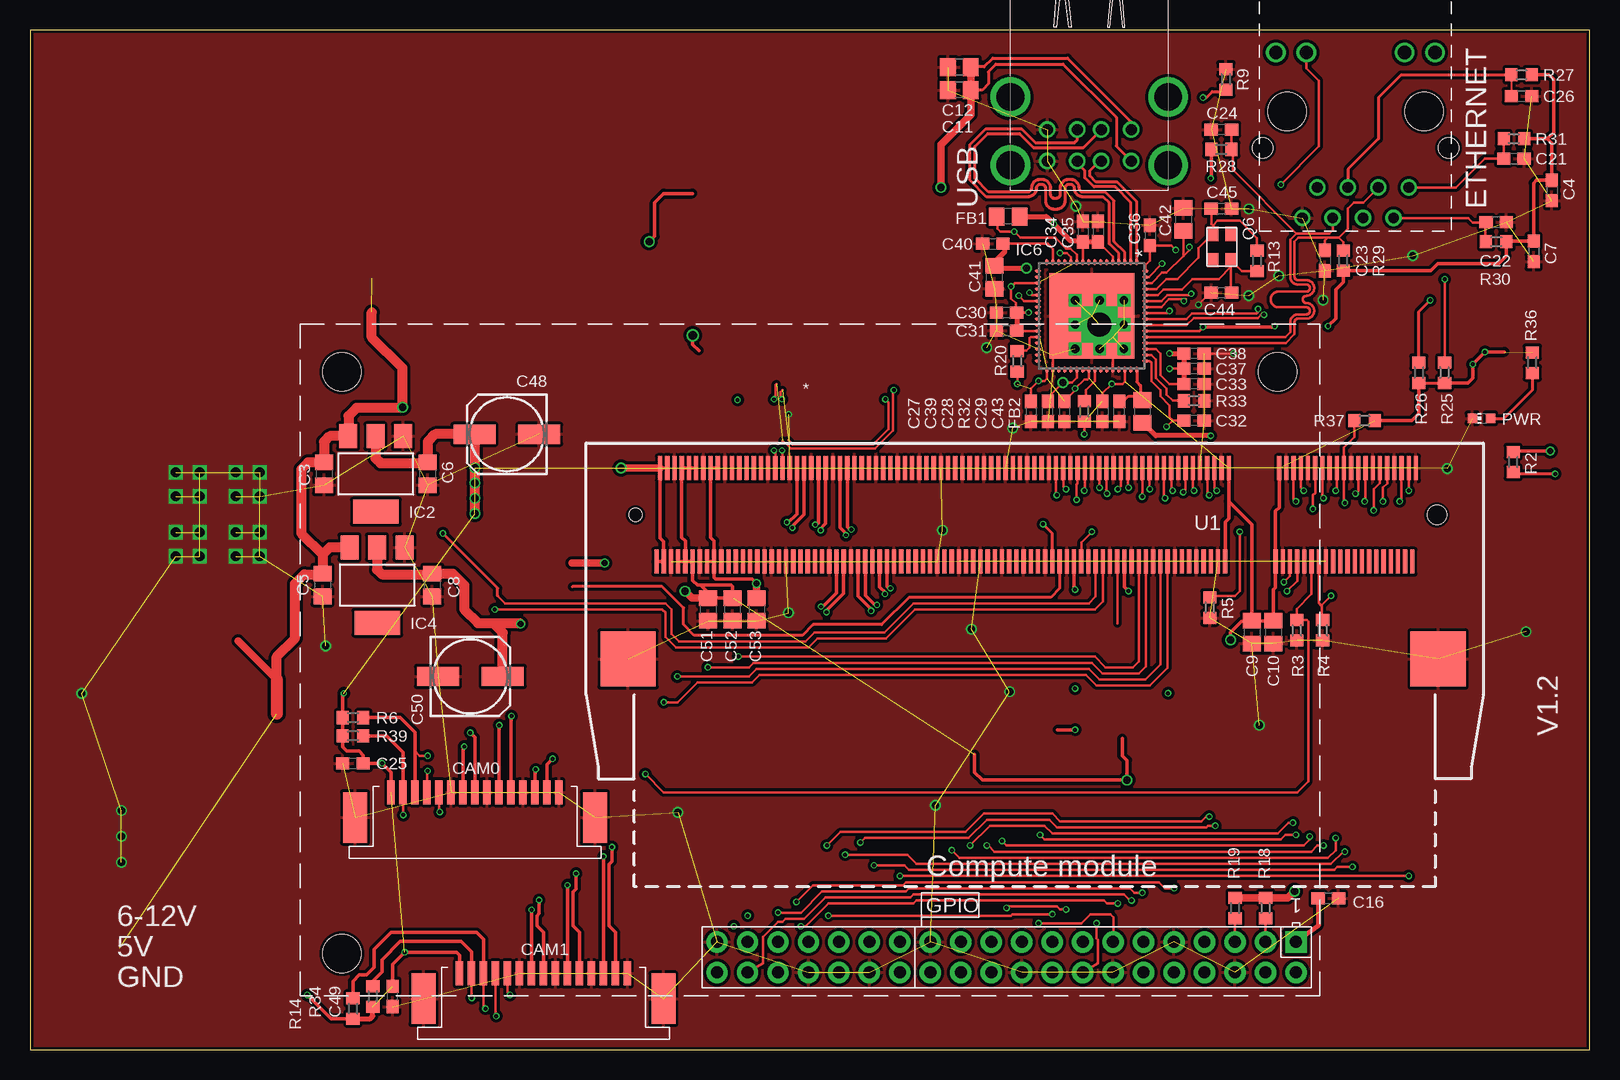
[diagram p3: board, top side]
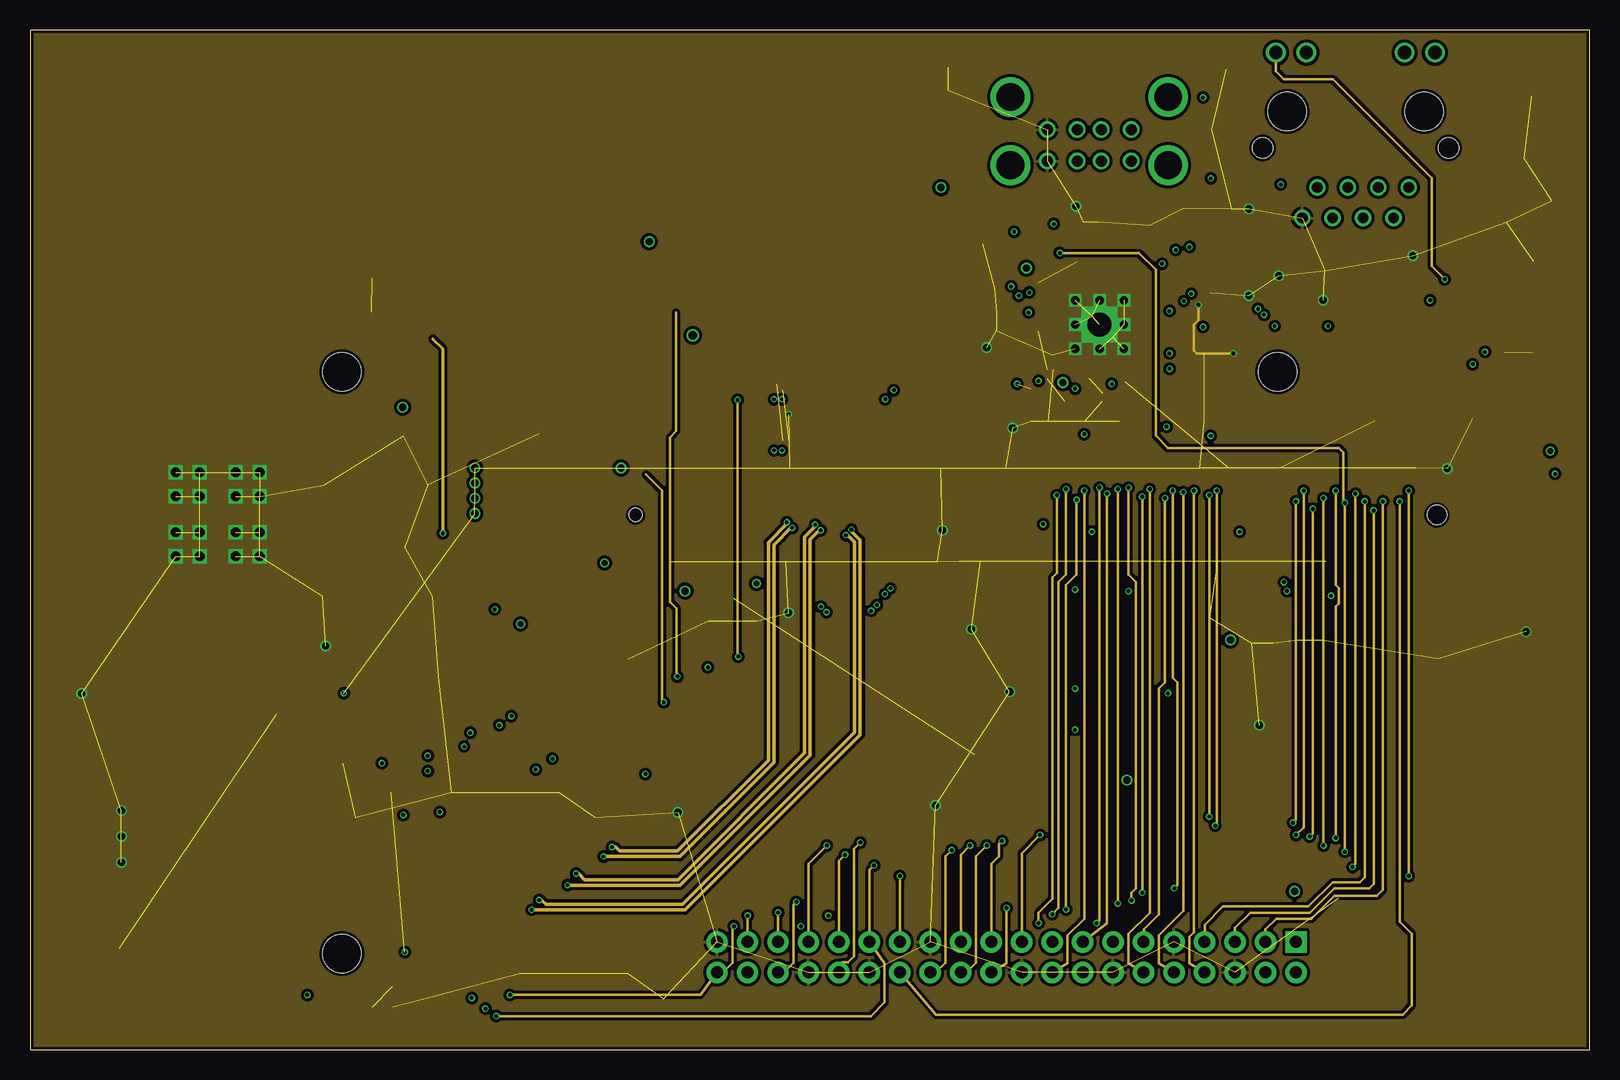
[diagram p4: board, inner layer Route2]
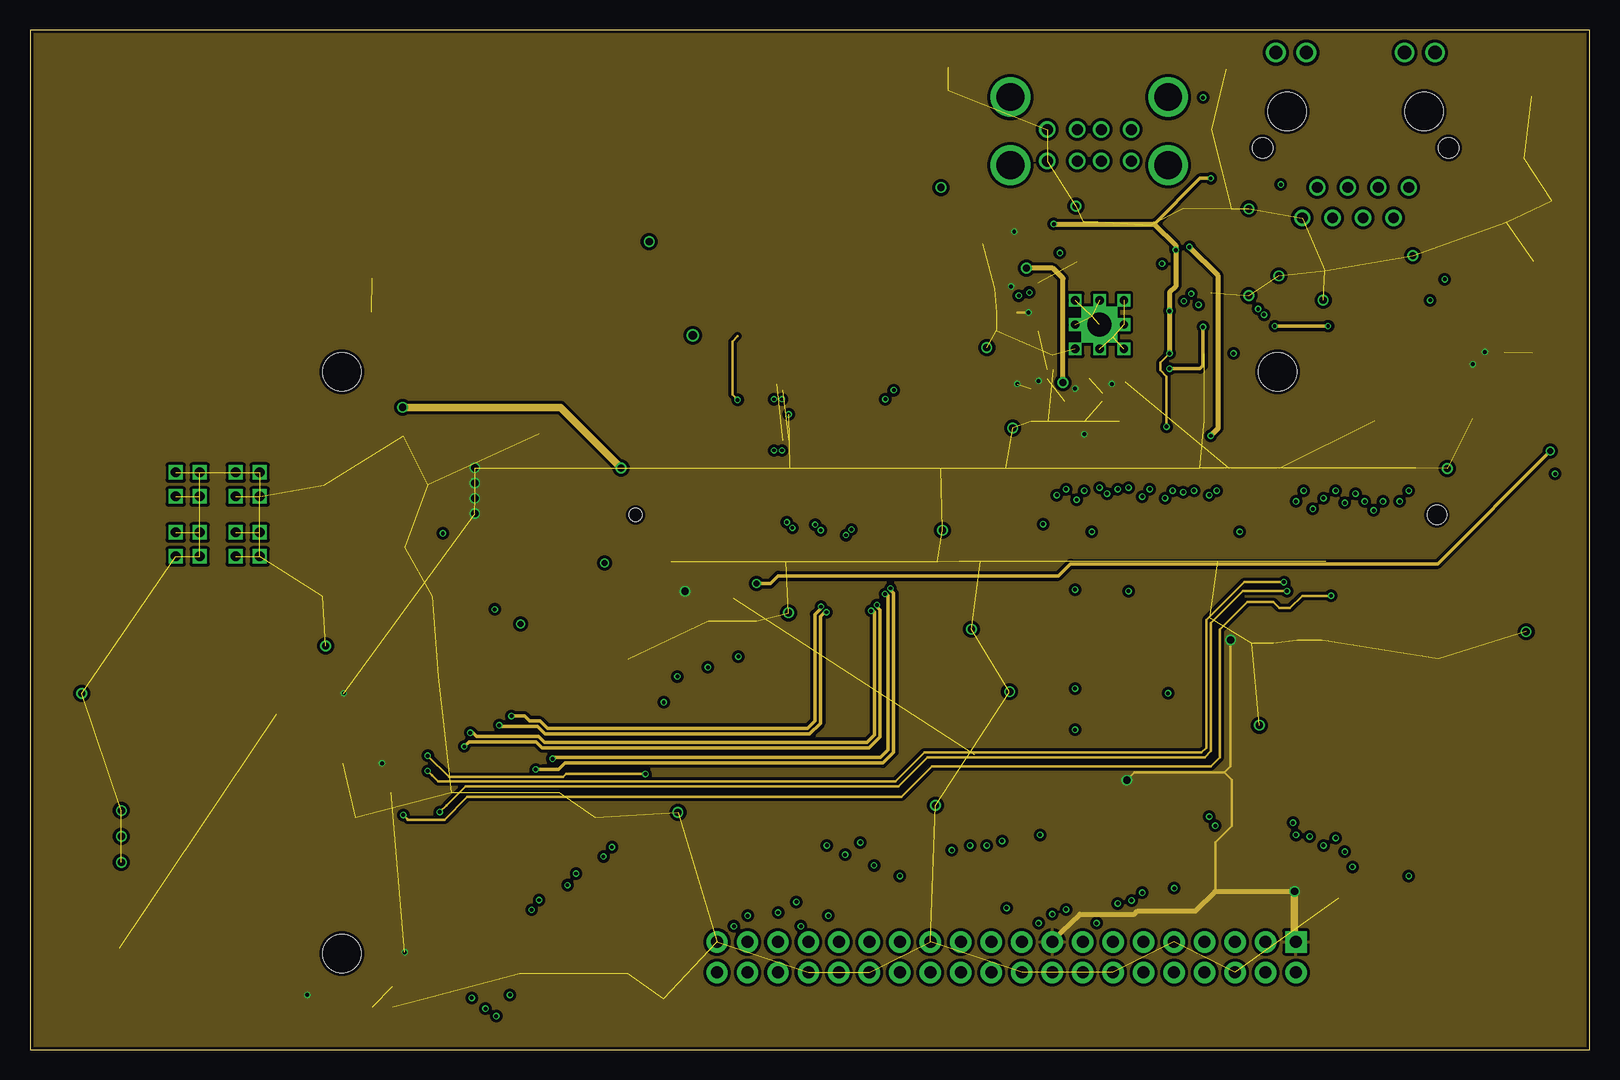
[diagram p5: board, inner layer Route15]
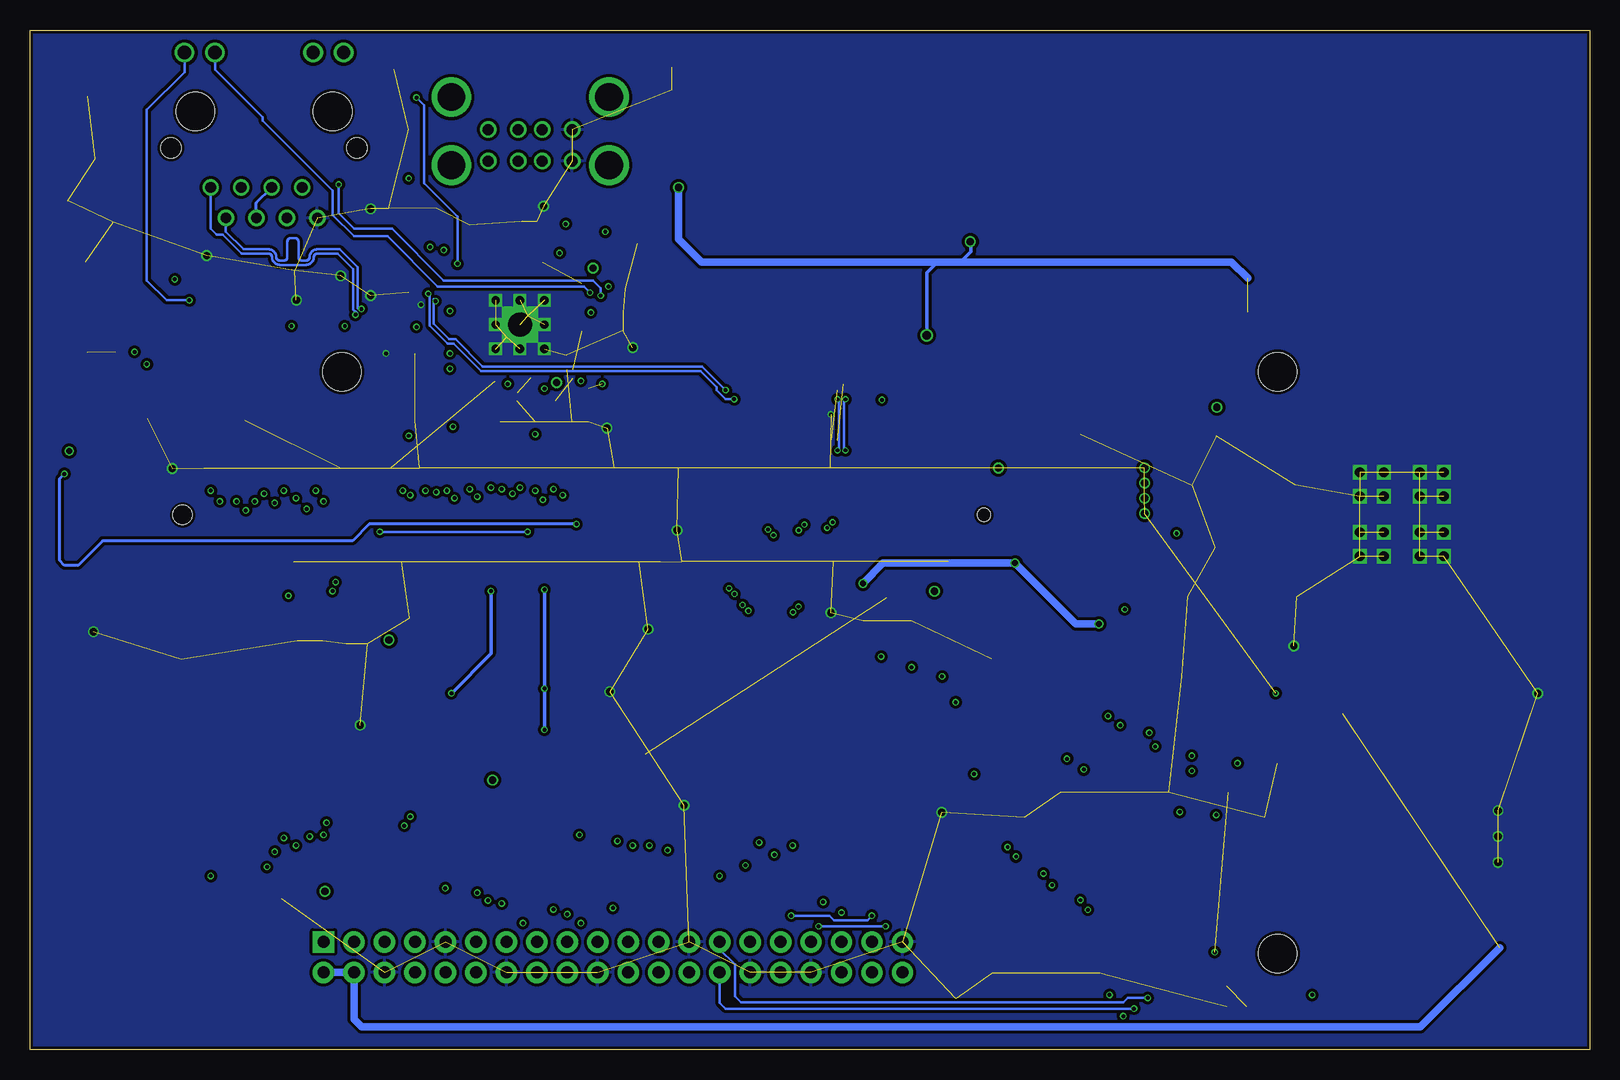
[diagram p6: board, bottom side, seen from below]

Size 130 x 85 mm. Coordinates in mm from the lower left corner, seen from the top.
Outline: 0,0 130,0 130,85 0,85 0,0
Copper layers (1*2*15*16): Top 0.035mm / dielectric 0.2mm / Route2 0.0175mm / dielectric 0.3mm / Route15 0.0175mm / dielectric 0.2mm / Bottom 0.035mm
Design rules "SeeedStudio_4layer_DRU_no_angle_20140221 *": minimum track width 6mil, minimum drill 12mil, track to track 6mil, track to pad 6mil, pad to pad 6mil, via to via 6mil, smd to smd 0mil, copper to edge 10mil, drill to drill 8mil, minimum pad ring 6mil, minimum via ring 4mil, stop-mask expansion 4mil, vias tented up to drill 100mil, thermal gap 10mil

### Footprints (pad centres in the part's own frame; a part is rotated, then mirrored left to right if it is on the bottom)
C0805 = smd 1.3 x 1.5: 1 -0.95,0; 2 0.95,0
C0603 = smd 1.1 x 1: 1 -0.85,0; 2 0.85,0
153CLV-0605 = smd 3.5 x 1.6: + 2.7,0; - -2.7,0
FFC-15 = smd 0.6 x 2: P$1 7,0; P$2 6,0; P$3 5,0; P$4 4,0; P$5 3,0; P$6 2,0; P$7 1,0; P$8 0,0; P$9 -1,0; P$10 -2,0; P$11 -3,0; P$12 -4,0; P$13 -5,0; P$14 -6,0; P$15 -7,0 | smd 2 x 4.2: P$16 -10,-2.1; P$17 10,-2.1
RJ45 = drill 0.9: 1 4.45,-6.35; 2 3.18,-8.89; 3 1.91,-6.35; 4 0.64,-8.89; 5 -0.63,-6.35; 6 -1.9,-8.89; 7 -3.17,-6.35; 8 -4.44,-8.89 | drill 1.1: 9 6.63,4.9; 10 4.09,4.9; 11 -4.09,4.9; 12 -6.63,4.9 | hole 3.2: 5.715,0; -5.715,0 | hole 1.7: -7.75,-3.05; 7.75,-3.05
RASPI_GPIO_B+_PIN = drill 1 pad 1.778 square: 1 1.97,-4.47 | drill 1 pad 1.778: 2 1.97,-1.93; 3 4.51,-4.47; 4 4.51,-1.93; 5 7.05,-4.47; 6 7.05,-1.93; 7 9.59,-4.47; 8 9.59,-1.93; 9 12.13,-4.47; 10 12.13,-1.93; 11 14.67,-4.47; 12 14.67,-1.93; 13 17.21,-4.47; 14 17.21,-1.93; 15 19.75,-4.47; 16 19.75,-1.93; 17 22.29,-4.47; 18 22.29,-1.93; 19 24.83,-4.47; 20 24.83,-1.93; 21 27.37,-4.47; 22 27.37,-1.93; 23 29.91,-4.47; 24 29.91,-1.93; 25 32.45,-4.47; 26 32.45,-1.93; 27 34.99,-4.47; 28 34.99,-1.93; 29 37.53,-4.47; 30 37.53,-1.93; 31 40.07,-4.47; 32 40.07,-1.93; 33 42.61,-4.47; 34 42.61,-1.93; 35 45.15,-4.47; 36 45.15,-1.93; 37 47.69,-4.47; 38 47.69,-1.93; 39 50.23,-4.47; 40 50.23,-1.93 | hole 3.2: 3.5,-52; 81.5,-3.5; 81.5,-52
SOT223 = smd 1.499 x 2.007: 1 -2.261,-3.15; 2 0.025,-3.15; 3 2.311,-3.15 | smd 3.81 x 2.007: 4 0,3.15
QFN64-9X9 = smd 0.55 x 0.25: 1 -4.477,3.75; 2 -4.477,3.25; 3 -4.477,2.75; 4 -4.477,2.25; 5 -4.477,1.75; 6 -4.477,1.25; 7 -4.477,0.75; 8 -4.477,0.25; 9 -4.477,-0.25; 10 -4.477,-0.75; 11 -4.477,-1.25; 12 -4.477,-1.75; 13 -4.477,-2.25; 14 -4.477,-2.75; 15 -4.477,-3.25; 16 -4.477,-3.75; 33 4.477,-3.75; 34 4.477,-3.25; 35 4.477,-2.75; 36 4.477,-2.25; 37 4.477,-1.75; 38 4.477,-1.25; 39 4.477,-0.75; 40 4.477,-0.25; 41 4.477,0.25; 42 4.477,0.75; 43 4.477,1.25; 44 4.477,1.75; 45 4.477,2.25; 46 4.477,2.75; 47 4.477,3.25; 48 4.477,3.75 | smd 0.25 x 0.55: 17 -3.75,-4.477; 18 -3.25,-4.477; 19 -2.75,-4.477; 20 -2.25,-4.477; 21 -1.75,-4.477; 22 -1.25,-4.477; 23 -0.75,-4.477; 24 -0.25,-4.477; 25 0.25,-4.477; 26 0.75,-4.477; 27 1.25,-4.477; 28 1.75,-4.477; 29 2.25,-4.477; 30 2.75,-4.477; 31 3.25,-4.477; 32 3.75,-4.477; 49 3.75,4.477; 50 3.25,4.477; 51 2.75,4.477; 52 2.25,4.477; 53 1.75,4.477; 54 1.25,4.477; 55 0.75,4.477; 56 0.25,4.477; 57 -0.25,4.477; 58 -0.75,4.477; 59 -1.25,4.477; 60 -1.75,4.477; 61 -2.25,4.477; 62 -2.75,4.477; 63 -3.25,4.477; 64 -3.75,4.477 | smd 7.1 x 7.1: EXP 0,0
CHIP-LED0603 = smd 0.8 x 0.8: A 0,-0.75; C 0,0.75
CTS_32X25 = smd 1.2 x 0.9: 1 -1.1,-0.7; 2 1.1,-0.7; 3 1.1,0.8; 4 -1.1,0.8
R0603 = smd 1 x 1.1: 1 -0.85,0; 2 0.85,0
SO-DIMM = smd 0.35 x 2: 1 -26.4,-3.9; 2 -26.1,3.9; 3 -25.8,-3.9; 4 -25.5,3.9; 5 -25.2,-3.9; 6 -24.9,3.9; 7 -24.6,-3.9; 8 -24.3,3.9; 9 -24,-3.9; 10 -23.7,3.9; 11 -23.4,-3.9; 12 -23.1,3.9; 13 -22.8,-3.9; 14 -22.5,3.9; 15 -22.2,-3.9; 16 -21.9,3.9; 17 -21.6,-3.9; 18 -21.3,3.9; 19 -21,-3.9; 20 -20.7,3.9; 21 -20.4,-3.9; 22 -20.1,3.9; 23 -19.8,-3.9; 24 -19.5,3.9; 25 -19.2,-3.9; 26 -18.9,3.9; 27 -18.6,-3.9; 28 -18.3,3.9; 29 -18,-3.9; 30 -17.7,3.9; 31 -17.4,-3.9; 32 -17.1,3.9; 33 -16.8,-3.9; 34 -16.5,3.9; 35 -16.2,-3.9; 36 -15.9,3.9; 37 -15.6,-3.9; 38 -15.3,3.9; 39 -15,-3.9; 40 -14.7,3.9; 41 -10.8,-3.9; 42 -10.5,3.9; 43 -10.2,-3.9; 44 -9.9,3.9; 45 -9.6,-3.9; 46 -9.3,3.9; 47 -9,-3.9; 48 -8.7,3.9; 49 -8.4,-3.9; 50 -8.1,3.9; 51 -7.8,-3.9; 52 -7.5,3.9; 53 -7.2,-3.9; 54 -6.9,3.9; 55 -6.6,-3.9; 56 -6.3,3.9; 57 -6,-3.9; 58 -5.7,3.9; 59 -5.4,-3.9; 60 -5.1,3.9; 61 -4.8,-3.9; 62 -4.5,3.9; 63 -4.2,-3.9; 64 -3.9,3.9; 65 -3.6,-3.9; 66 -3.3,3.9; 67 -3,-3.9; 68 -2.7,3.9; 69 -2.4,-3.9; 70 -2.1,3.9; 71 -1.8,-3.9; 72 -1.5,3.9; 73 -1.2,-3.9; 74 -0.9,3.9; 75 -0.6,-3.9; 76 -0.3,3.9; 77 0,-3.9; 78 0.3,3.9; 79 0.6,-3.9; 80 0.9,3.9; 81 1.2,-3.9; 82 1.5,3.9; 83 1.8,-3.9; 84 2.1,3.9; 85 2.4,-3.9; 86 2.7,3.9; 87 3,-3.9; 88 3.3,3.9; 89 3.6,-3.9; 90 3.9,3.9; 91 4.2,-3.9; 92 4.5,3.9; 93 4.8,-3.9; 94 5.1,3.9; 95 5.4,-3.9; 96 5.7,3.9; 97 6,-3.9; 98 6.3,3.9; 99 6.6,-3.9; 100 6.9,3.9; 101 7.2,-3.9; 102 7.5,3.9; 103 7.8,-3.9; 104 8.1,3.9; 105 8.4,-3.9; 106 8.7,3.9; 107 9,-3.9; 108 9.3,3.9; 109 9.6,-3.9; 110 9.9,3.9; 111 10.2,-3.9; 112 10.5,3.9; 113 10.8,-3.9; 114 11.1,3.9; 115 11.4,-3.9; 116 11.7,3.9; 117 12,-3.9; 118 12.3,3.9; 119 12.6,-3.9; 120 12.9,3.9; 121 13.2,-3.9; 122 13.5,3.9; 123 13.8,-3.9; 124 14.1,3.9; 125 14.4,-3.9; 126 14.7,3.9; 127 15,-3.9; 128 15.3,3.9; 129 15.6,-3.9; 130 15.9,3.9; 131 16.2,-3.9; 132 16.5,3.9; 133 16.8,-3.9; 134 17.1,3.9; 135 17.4,-3.9; 136 17.7,3.9; 137 18,-3.9; 138 18.3,3.9; 139 18.6,-3.9; 140 18.9,3.9; 141 19.2,-3.9; 142 19.5,3.9; 143 19.8,-3.9; 144 20.1,3.9; 145 20.4,-3.9; 146 20.7,3.9; 147 21,-3.9; 148 21.3,3.9; 149 21.6,-3.9; 150 21.9,3.9; 151 22.2,-3.9; 152 22.5,3.9; 153 22.8,-3.9; 154 23.1,3.9; 155 23.4,-3.9; 156 23.7,3.9; 157 24,-3.9; 158 24.3,3.9; 159 24.6,-3.9; 160 24.9,3.9; 161 25.2,-3.9; 162 25.5,3.9; 163 25.8,-3.9; 164 26.1,3.9; 165 26.4,-3.9; 166 26.7,3.9; 167 27,-3.9; 168 27.3,3.9; 169 27.6,-3.9; 170 27.9,3.9; 171 28.2,-3.9; 172 28.5,3.9; 173 28.8,-3.9; 174 29.1,3.9; 175 29.4,-3.9; 176 29.7,3.9; 177 30,-3.9; 178 30.3,3.9; 179 30.6,-3.9; 180 30.9,3.9; 181 31.2,-3.9; 182 31.5,3.9; 183 31.8,-3.9; 184 32.1,3.9; 185 32.4,-3.9; 186 32.7,3.9; 187 33,-3.9; 188 33.3,3.9; 189 33.6,-3.9; 190 33.9,3.9; 191 34.2,-3.9; 192 34.5,3.9; 193 34.8,-3.9; 194 35.1,3.9; 195 35.4,-3.9; 196 35.7,3.9; 197 36,-3.9; 198 36.3,3.9; 199 36.6,-3.9; 200 36.9,3.9 | smd 4.6 x 4.6: G1 -28.254,12; G2 39.27,12 | hole 1.6: -28.15,0 | hole 1.1: 38.65,0
USB2 = drill 0.92 pad 1.27: 1-1 2.71,3.5; 1-2 2.71,1; 1-3 2.71,-1; 1-4 2.71,-3.5; 2-1 5.33,3.5; 2-2 5.33,1; 2-3 5.33,-1; 2-4 5.33,-3.5 | drill 2.3 pad 3: M1 0,6.57; M2 0,-6.57; M3 5.68,6.57; M4 5.68,-6.57

### Placement (x,y rotation side)
C3  24.51,47.99 270 top
C4  126.87,71.61 270 top
C5  24.38,38.72 270 top
C6  33.15,47.99 270 top
C7  125.35,66.53 270 top
C8  33.53,38.72 270 top
C9  101.85,34.78 270 top
C10  103.63,34.78 270 top
C11  77.47,80 180 top
C12  77.47,81.9 180 top
C16  108.23,12.59 180 top
C21  123.7,74.28 0 top
C22  122.22,69 0 top
C23  107.95,65.77 270 top
C24  99.31,76.69 180 top
C25  26.92,23.86 0 top
C26  124.33,79.49 0 top
C27  83.44,53.2 270 top
C28  86.23,53.2 270 top
C29  89.41,53.2 270 top
C30  81.41,61.45 0 top
C31  81.41,59.93 0 top
C32  97.03,52.44 180 top
C33  97.03,55.48 180 top
C34  87.76,68.19 270 top
C35  89.03,68.19 270 top
C36  93.37,67.86 270 top
C37  97.03,56.75 180 top
C38  97.03,58.03 180 top
C39  84.84,53.2 90 top
C40  80.26,67.17 0 top
C41  80.39,64.38 90 top
C42  96.14,69.2 270 top
C43  90.81,53.2 90 top
C44  99.31,63.11 0 top
C45  99.31,70.09 180 top
C48  39.75,51.29 180 top
C49  30.23,4.43 90 top
C50  36.7,31.1 0 top
C51  56.52,36.69 270 top
C52  58.55,36.69 270 top
C53  60.58,36.69 270 top
CAM0  37.08,21.45 0 top
CAM1  42.8,6.34 0 top
ETHERNET  110.49,78.22 0 top
FB1  81.53,69.45 180 top
FB2  92.71,53.2 270 top
GPIO  107.5,4.5 180 top
IC2  28.83,47.99 180 top
IC4  28.96,38.72 180 top
IC6  88.51,61.16 270 top
PWR  120.99,52.62 90 top
Q6  99.31,66.92 270 top
R2  123.64,48.98 90 top
R3  105.59,34.94 270 top
R4  107.75,34.94 270 top
R5  98.35,36.85 270 top
R6  26.92,27.67 180 top
R9  99.69,80.89 270 top
R13  102.29,65.75 90 top
R14  26.92,3.41 270 top
R18  103,11.8 270 top
R19  100.46,11.8 270 top
R20  82.3,57.39 270 top
R25  117.91,56.43 90 top
R26  115.78,56.43 90 top
R27  124.33,81.27 180 top
R28  99.31,75.04 0 top
R29  109.47,65.77 90 top
R30  122.22,67.35 180 top
R31  123.7,75.93 180 top
R32  87.88,53.2 270 top
R33  97.03,54.09 0 top
R34  28.57,4.43 270 top
R36  125.22,57.26 90 top
R37  111.25,52.44 180 top
R39  26.92,26.15 180 top
U1  89.13,44.57 180 top
USB  88.3,79.41 270 top

### Tracks (layer width: path | path; a pad name or v marks a point on that pad's centre or on a via)
1V8  (via drill 0.5)
  Top 0.305: U1.183 U1.185 56.73,42.7 57.03,42.4 U1.184 | U1.184 U1.186 | v60.58,38.85 60.2,39.23 57.15,39.23 57.03,39.35 U1.184 | v126.75,49.9 123.67,49.9 R2.2
  Top 0.61: v47.88,40.55 45.19,40.55 | v60.58,38.85 C53.1
  Top 0.813: IC4.2 28.93,40.02 29.34,39.61 33.47,39.61 C8.1 35.24,39.67 36.2,38.72 36.2,36.69 37.34,35.55 38.61,35.55 | 38.61,35.55 40.84,35.55 v40.89,35.49 | C50.+ 39.4,34.75 38.61,35.55
  Route15 0.305: v60.58,38.85 61.72,38.85 62.36,39.48 85.72,39.48 86.74,40.5 117.35,40.5 v126.75,49.9
  Bottom 0.61: v40.89,35.49 42.82,35.49 v47.88,40.55 58.88,40.55 v60.58,38.85
3V3  (via drill 0.3, 0.33, 0.6)  (17 unrouted)
  Top 0.203: IC6.39 IC6.40 88.26,55.99 88.14,55.87 87.88,55.87 v87.12,55.1 87.12,54.94 C28.1 | IC6.11 87.26,66.27 86.74,66.79 86.36,66.79 85.47,67.68 82.55,67.68 v82.04,68.19 80.9,68.19 80.64,68.44 80.64,69.39 FB1.2 | IC6.27 82.28,59.91 C31.2 | v83.24,61.45 C30.2 82.17,61.54 82.17,62.22 81.79,62.6 v81.79,63.61 82.08,63.91 IC6.19 | IC6.46 91.26,55.69 91.06,55.48 v90.17,55.48 89.41,54.72 C29.1 | R32.2 v87.88,51.29 | IC6.33 84.76,55.92 84.58,55.74 v84.07,55.74 83.44,55.1 C27.1 | R20.2 v82.3,55.48
  Top 0.254: R26.1 R25.1
  Top 0.305: U1.39 104.13,45.19 103.83,44.88 U1.40 103.83,38.53 103.63,38.34 C10.1 C9.1 | U1.41 99.93,45.71 | 99.93,45.71 99.93,44.29 99.63,43.99 U1.42 | C9.1 101.85,43.78 99.93,45.71 | U1.194 U1.192 | U1.192 54.63,42.39 54.33,42.69 U1.193 U1.191 U1.189 | 55.88,38.72 58.42,38.72 58.55,38.59 C52.1 | 55.88,38.72 55.63,38.72 55.23,39.12 U1.190 U1.192 | v100.08,34.15 100.08,34.78 100.97,35.67 101.79,35.67 C9.1 | 91.06,25.93 91.06,24.5 91.44,24.12 v91.44,22.47 79.38,22.47 78.74,23.1 78.74,24.6 | 55.88,38.72 56.52,38.09 C51.1 58.61,37.64 58.67,37.7 | R25.1 119.85,55.58 120.27,55.99 v120.27,57.14 v121.28,58.15 122.9,58.15 | R37.1 115.19,52.44 115.78,53.02 R26.1 | CAM0.P$15 30.08,23.12 v29.34,23.86 C25.2 27.77,24.54 27.43,24.88 26.42,24.88 26.07,25.22 R39.2 R6.2 26.07,29.62 v26.16,29.7 | CAM1.P$15 35.8,7.88 35.56,8.11 v31.24,8.11 30.23,7.1 C49.2 | R14.2 25.11,2.57 v23.11,4.56
  Top 0.406: C16.2 107.38,10.32 GPIO.1 | C30.2 C31.2 | R14.2 28.36,2.57 28.57,2.78 R34.2
  Top 0.61: R19.1 R18.1 104.86,12.65 v105.41,13.19 | C51.1 55.18,37.64 v54.61,38.21
  Top 0.813: IC2.2 28.8,49.29 29.21,48.88 33.09,48.88 C6.1 33.15,50.66 33.78,51.29 C48.+ 37.05,44.72 v37.08,44.69
  Route15 0.203: v100.08,34.15 100.08,23.61 99.57,23.1 | 98.81,13.19 98.81,17.26 100.2,18.66 100.2,22.47 99.57,23.1 | 99.57,23.1 92.08,23.1 v91.44,22.47 | v83.24,61.45 82.3,61.45
  Route15 0.406: GPIO.17 85.21,9.12 87.5,11.29 92.08,11.29 92.33,11.54 97.16,11.54 98.81,13.19 v105.41,13.19
  Route15 0.61: v105.41,13.19 105.41,8.59 GPIO.1
  other vias: 37.08,45.96 37.08,47.23 37.08,48.5
  pour Route15 (isolate 0.254): 0.3,0.3 129.7,0.3 129.7,84.7 0.3,84.7
3V3A  (via drill 0.3, 0.33)
  Top 0.203: IC6.10 87.76,67.38 C34.2 | 93.34,66.99 93.34,65.77 92.99,65.42 IC6.64 | IC6.57 94.83,61.41 v95,61.58 | v95,56.75 C37.2 | IC6.51 93.85,58.41 94.23,58.03 94.23,56.25 95,55.48 C33.2 | IC6.49 93.33,57.41 93.47,57.26 93.47,55.74 94.23,54.98 94.23,54.47 95,53.71 95,52.69 95.25,52.44 | 95.25,52.44 C32.2 | C36.2 95.15,67.01 v95.5,66.66 | 95.25,52.44 v94.74,51.93 | IC6.5 90.26,66.1 C35.2 | IC6.54 97.47,59.91 v97.79,60.23
  Top 0.305: R30.1 123.06,67.33 123.06,66.15 122.43,65.52 117.35,65.52 116.75,64.92 R29.1 109.47,63.99 108.84,63.36 108.84,60.95 v108.2,60.31 | R27.1 126.62,81.27 127,80.89 127,76.44 126.49,75.93 | 126.49,75.93 R31.1 | 126.49,75.93 126.86,75.57 C4.1 125.56,72.46 125.35,72.25 C7.1 123.11,67.38 R30.1 | 123.15,67.42 R30.1 | R28.1 98.46,72.67 v98.42,72.63 | v97.79,60.23 103.68,60.23 v103.76,60.31
  Top 0.406: 93.34,66.99 C36.2 | v95,58.03 C38.2 C37.2 C33.2 | 85.32,68.85 v85.34,68.82 | v85.34,68.82 86.74,67.42 87.67,67.42 C34.2 C35.2 | FB1.1 84.71,69.45 v85.34,68.82
  Route15 0.203: v94.74,51.93 94.74,56.12 94.23,56.63 94.23,57.26 v95,58.03
  Route15 0.305: v95,56.75 97.54,56.75 97.79,57.01 v97.79,60.23 | v98.42,72.63 97.54,72.63 93.73,68.82 | v103.76,60.31 v108.2,60.31
  Route15 0.406: v95,58.03 v95,61.58 95,63.11 95.5,63.61 v95.5,66.66 95.5,67.04 93.73,68.82 v85.34,68.82
+5V  (via drill 0.6, 0.7)  (2 unrouted)
  Top 0.254: USB.2-1 90.55,75.33 90.55,77.71 86.11,82.16 80.52,82.16 79.88,81.52 79.88,80.5 79.38,80 C11.1 | USB.1-1 91.82,76.72 91.82,77.33 86.49,82.66 80.26,82.66 79.53,81.92 78.44,81.92 C12.1
  Top 0.305: U1.197 U1.199 52.53,42.66 52.83,42.36 U1.198 U1.200 | v51.62,67.35 52.07,67.8 52.07,70.6 52.83,71.36 55.22,71.36 | 55.75,58.28 55.24,58.79 v55.24,59.55
  Top 0.61: v75.95,71.87 75.95,75.42 78.45,77.93 78.45,79.49 | 31.05,53.49 v31.05,53.54 | v49.28,48.48 U1.199 | 17.34,34.08 20.57,30.85 | 78.45,79.49 78.45,79.97 C11.1 | C12.1 C11.1 | C11.1 78.42,79.52 78.45,79.49
  Top 0.813: 28.5,61.48 28.5,59.37 31.05,56.82 v31.05,53.54 | 31.05,53.49 27.22,53.49 26.54,52.82 26.54,51.17 IC2.3 24.99,51.14 24.51,50.66 C3.1 23.18,48.94 22.61,48.37 22.61,43.04 24.38,41.26 | 20.57,30.85 20.57,32.75 22.1,34.28 22.1,38.85 22.86,39.61 24.32,39.61 C5.1 24.38,41.26 | IC4.3 24.99,41.87 24.38,41.26
  Top 1.016: 20.57,30.85 20.57,28
  Route15 0.61: v31.05,53.54 44.21,53.54 v49.28,48.48
  Bottom 0.305: 52.45,65.64 51.56,66.53 51.56,67.3 v51.62,67.35 | v55.24,59.55 55.24,64.76 54.36,65.64
  Bottom 0.61: v75.95,71.87 75.95,67.55 74.04,65.64 54.36,65.64 52.45,65.64 29.84,65.64 28.5,64.3 | GPIO.2 GPIO.4 102.99,2.52 102.36,1.89 14.1,1.89 7.49,8.5
CAM0_C_N  (via drill 0.33)
  Top 0.305: U1.144 69.03,37.82 70.2,36.65 v70.12,36.57 | CAM0.P$8 37.08,26.02 v36.7,26.4
  Route15 0.305: v70.12,36.57 70.2,36.65 70.38,36.47 70.38,26.24 69.75,25.62 42.89,25.62 42.39,26.12 37.21,26.12 36.93,26.4 v36.7,26.4
CAM0_C_P  (via drill 0.3, 0.33)
  Top 0.305: U1.142 69.63,37.87 70.52,36.98 v70.6,37.06 | CAM0.P$9 36.08,25.15 v36.2,25.26
  Route15 0.305: v70.6,37.06 70.52,36.98 70.84,36.66 70.84,26.05 69.94,25.16 42.7,25.16 42.2,25.66 36.6,25.66 v36.2,25.26
CAM0_D0_N  (via drill 0.3, 0.33)
  Top 0.305: U1.138 70.83,38.56 71.34,38.05 v71.27,37.98 | CAM0.P$2 43.08,23.77 v43.56,24.24
  Route15 0.305: v71.27,37.98 71.34,38.05 71.53,37.86 71.53,24.97 70.9,24.34 43.66,24.34 v43.56,24.24
CAM0_D0_P  (via drill 0.3, 0.33)
  Top 0.305: U1.136 71.43,38.61 71.66,38.38 v71.73,38.45 | CAM0.P$3 42.08,23.27 v42.16,23.35
  Route15 0.305: v71.73,38.45 71.66,38.38 71.98,38.05 71.98,24.78 71.09,23.89 44.6,23.89 44.07,23.35 42.67,23.35 v42.16,23.35
CAM0_D1_N  (via drill 0.3, 0.33)
  Top 0.305: U1.150 67.23,38.07 66,36.85 v65.93,36.92 | CAM0.P$5 40.08,27.75 v40.13,27.8
  Route15 0.305: v65.93,36.92 66,36.85 65.43,36.28 65.43,27.39 64.8,26.76 43.15,26.76 42.51,27.39 41.63,27.39 41.22,27.8 v40.13,27.8
CAM0_D1_P  (via drill 0.3, 0.33)
  Top 0.305: U1.148 67.83,38.03 66.33,36.53 v66.4,36.46 | CAM0.P$6 39.08,27.01 v39.12,27.04
  Route15 0.305: v66.4,36.46 66.33,36.53 65.89,36.09 65.89,27.2 64.99,26.3 42.96,26.3 42.32,26.94 39.22,26.94 v39.12,27.04
CAM1_C_N  (via drill 0.3)
  Top 0.305: U1.149 67.53,43.52 68.09,42.95 v68.02,42.88 | CAM1.P$8 42.8,9.77 42.27,10.3 42.27,11.16 42.44,11.34 v42.44,12.46
  Route2 0.305: v68.02,42.88 68.09,42.95 68.73,42.31 68.73,26.42 54.41,12.1 43,12.1 42.65,12.46 v42.44,12.46
CAM1_C_P  (via drill 0.3)
  Top 0.305: U1.147 68.13,43.56 68.41,43.28 v68.48,43.35 | CAM1.P$9 41.8,11.64 v41.81,11.64
  Route2 0.305: v68.48,43.35 68.41,43.28 69.19,42.5 69.19,26.23 54.6,11.64 v41.81,11.64
CAM1_D0_N  (via drill 0.3)
  Top 0.305: U1.161 63.93,44.65 63.16,43.89 v63.09,43.96 | CAM1.P$2 48.8,9.76 48.26,10.3 48.26,15.43 48.51,15.68 v48.51,16.88
  Route2 0.305: v63.09,43.96 63.16,43.89 61.54,42.27 61.54,24.11 53.98,16.55 49.15,16.55 48.82,16.88 v48.51,16.88
CAM1_D0_P  (via drill 0.3)
  Top 0.305: U1.159 64.53,44.61 63.48,43.56 v63.56,43.49 | CAM1.P$3 v47.8,16.09
  Route2 0.305: v63.56,43.49 63.48,43.56 62,42.08 62,23.92 54.17,16.09 v47.8,16.09
CAM1_D1_N  (via drill 0.3)
  Top 0.305: U1.155 65.73,43.89 65.52,43.68 v65.45,43.76 | CAM1.P$5 45.8,9.76 45.26,10.3 45.26,13.14 45.52,13.4 v45.52,14.67
  Route2 0.305: v65.45,43.76 65.52,43.68 64.57,42.73 64.57,24.72 54.01,14.16 46.23,14.16 45.72,14.67 v45.52,14.67
CAM1_D1_P  (via drill 0.3)
  Top 0.305: U1.153 66.33,43.84 65.85,43.36 v65.92,43.29 | CAM1.P$6 44.8,13.7 v44.81,13.7
  Route2 0.305: v65.92,43.29 65.85,43.36 65.02,42.54 65.02,24.53 54.2,13.7 v44.81,13.7
GND  (via drill 0.33, 0.6, 0.7, 0.8, 2)  (182 unrouted)
  Top 0.203: v100.33,58.03 C38.1 | IC6.44 90.26,59.41 IC6.EXP 85.26,57.91 IC6.34 | 98.42,63.11 v97.41,62.09
  Top 0.254: U1.122 75.65,40.67 75.69,40.63
  Route2 0.203: v97.41,62.09 97.41,60.82 97.03,60.44 97.03,58.28 97.28,58.03 v100.33,58.03
  other vias: 12.14,48.11 14.14,48.11 17.14,48.11 19.14,48.11 19.14,46.11 17.14,46.11 14.14,46.11 12.14,46.11 12.14,43.11 14.14,43.11 17.14,43.11 19.14,43.11 19.14,41.11 17.14,41.11 14.14,41.11 12.14,41.11 91.19,58.41 7.62,19.92 24.64,33.64 7.62,17.77 102.49,27.04 75.49,20.35 54.01,19.76 76.07,43.29 81.92,51.8 79.76,58.53 63.22,36.41 87.2,70.32 101.6,70.09 91.19,60.44 91.19,62.47 89.15,62.47 89.15,60.44 89.15,58.41 87.12,58.41 87.12,60.44 87.12,62.47 4.32,29.68 101.6,62.85 104.11,64.5 115.27,66.18 124.71,34.83 118.14,48.45 107.8,62.47 7.62,15.61 78.49,35.04 81.66,29.83 63.25,52.94
  pour Bottom (isolate 0.254): 0.3,84.7 129.7,84.7 129.7,0.3 0.3,0.3
  pour Top (isolate 0.254): 0.3,84.7 129.7,84.7 129.7,0.3 0.3,0.3
  pour Route2 (isolate 0.254): 0.3,0.3 129.7,0.3 129.7,84.7 0.3,84.7
GPIO0  (via drill 0.33)
  Top 0.203: U1.3 114.93,46.6 v114.94,46.59 | v114.94,14.46 v72.52,14.46 | CAM1.P$14 36.8,4.34 v36.83,4.3
  Top 0.305: R34.1 28.57,5.7 29.34,6.46 29.34,7.48 30.86,9 35.94,9 36.8,8.14 CAM1.P$14
  Route2 0.203: v114.94,46.59 v114.94,14.46 | GPIO.27 v72.51,14.46 v72.52,14.46
  Bottom 0.203: v36.83,4.3 38.48,4.3 38.86,3.92 70.74,3.92 71.25,4.43 71.25,7.1 72.51,8.36 GPIO.27
GPIO1  (via drill 0.33)
  Top 0.203: CAM1.P$13 37.8,3.59 v37.97,3.41 | U1.5 114.33,45.86 v114.17,45.71
  Top 0.305: R14.1 26.92,5.7 27.43,6.21 28.07,6.21 28.7,6.84 28.7,8.37 30.1,9.77 37.21,9.77 37.8,9.18 CAM1.P$13
  Route2 0.203: v114.17,45.71 114.17,10.65 115.19,9.64 115.19,3.67 114.43,2.91 75.53,2.91 GPIO.28
  Bottom 0.203: v37.97,3.41 72.01,3.41 72.51,3.92 GPIO.28
GPIO2  (via drill 0.33)
  Top 0.203: GPIO.3 102.99,10.84 R18.2 | U1.9 113.13,47.2 112.78,46.85 v112.78,45.71
  Route2 0.203: v112.78,45.71 112.78,13.32 112.27,12.81 108.71,12.81 106.81,10.91 103.88,10.91 102.99,10.02 GPIO.3
GPIO3  (via drill 0.33)
  Top 0.203: U1.11 112.53,47.23 112.01,46.72 v112.01,44.94 | R19.2 100.46,8.48 GPIO.5
  Route2 0.203: v112.01,44.94 112.01,13.83 111.63,13.45 108.71,13.45 106.68,11.42 101.73,11.42 100.46,10.15 100.46,8.48 GPIO.5
GPIO4  (via drill 0.33)
  Top 0.203: U1.15 111.33,45.78 v111.25,45.71
  Route2 0.203: v111.25,45.71 111.25,14.34 110.87,13.96 108.58,13.96 106.55,11.92 99.44,11.92 97.92,10.4 97.92,8.48 GPIO.7
GPIO5  (via drill 0.33)
  Top 0.203: U1.17 110.73,46.58 v110.49,46.34 | v110.24,15.23 108.97,15.23 108.71,14.97 73.28,14.97 72.9,15.35 v70.36,15.35 | CAM1.P$12 38.8,2.84 v38.86,2.78
  Route2 0.203: v110.49,46.34 110.49,15.48 v110.24,15.23 | v70.36,15.35 69.97,14.96 GPIO.29 71.25,7.19 71.25,3.92 70.1,2.78 v38.86,2.78
GPIO6  (via drill 0.33)
  Top 0.203: v109.6,45.58 109.53,45.65 U1.21 109.53,50.2 110.4,51.08 R37.2 | v109.6,16.5 109.47,16.5 108.46,15.48 73.91,15.48 73.15,16.24 v67.94,16.24 | IC6.12 86.76,66.08 86.44,66.41 v85.85,66.41
  Route2 0.203: v109.6,16.5 v109.6,45.58 109.47,45.71 109.47,49.77 109.09,50.15 94.87,50.15 93.85,51.17 93.85,65.01 92.46,66.41 v85.85,66.41 | GPIO.31 67.43,15.73 v67.94,16.24
GPIO7  (via drill 0.33)
  Top 0.203: U1.23 108.93,46.68 v108.84,46.59 | v108.84,17.64 108.84,16.62 108.2,15.99 77.47,15.99 v76.83,16.62
  Route2 0.203: v108.84,46.59 108.84,38.72 109.09,38.47 109.09,37.2 108.84,36.94 v108.84,17.64 | GPIO.26 75.05,5.95 76.33,7.23 76.33,16.11 v76.83,16.62
GPIO8  (via drill 0.33)
  Top 0.203: U1.27 107.73,46.06 v107.82,45.96 | v107.82,17 107.31,17 106.81,16.5 80.39,16.5 79.88,17 v79.76,17
  Route2 0.203: v107.82,45.96 v107.82,17 | GPIO.24 77.59,5.95 78.87,7.23 78.87,16.11 v79.76,17
GPIO9  (via drill 0.33)
  Top 0.203: U1.29 107.13,46.41 106.93,46.21 v106.93,45.07 | v106.68,17.77 106.68,17.51 106.17,17 81.41,17 v81.03,17.38
  Route2 0.203: v106.93,45.07 106.93,18.02 v106.68,17.77 | GPIO.21 80.13,15.47 80.77,16.11 80.77,17.13 v81.03,17.38
GPIO10  (via drill 0.33)
  Top 0.203: U1.33 105.93,46.84 v106.17,46.59 | v105.54,17.89 104.65,17.89 104.27,17.51 84.58,17.51 v84.2,17.89
  Route2 0.203: v106.17,46.59 106.17,18.53 v105.54,17.89 | GPIO.19 82.67,16.36 v84.2,17.89
GPIO11  (via drill 0.33)
  Top 0.203: U1.35 105.33,45.92 v105.54,45.71 | v105.28,18.91 104.9,18.91 104.01,18.02 85.22,18.02 84.58,18.66 80.01,18.66 v78.36,17
  Route2 0.203: v105.54,45.71 105.54,19.16 v105.28,18.91 | GPIO.23 77.59,16.23 v78.36,17
GPIO12  (via drill 0.33)
  Top 0.203: U1.45 98.73,46.8 v98.93,46.59 | v98.81,18.66 98.17,18.66 98.04,18.53 85.6,18.53 84.96,19.16 79.76,19.16 78.23,17.64 69.6,17.64 v69.22,17.26
  Route2 0.203: v98.93,46.59 98.93,18.78 v98.81,18.66 | v69.22,17.26 68.71,16.75 68.71,7.76 68.2,7.25 67.74,7.25 67.41,6.92 67.41,5.95 GPIO.32
GPIO13  (via drill 0.33)
  Top 0.203: U1.47 98.13,46.38 v98.3,46.21 | v98.3,19.42 98.04,19.42 97.66,19.04 85.85,19.04 85.22,19.67 79.5,19.67 77.98,18.15 67.56,18.15 v66.42,17
  Route2 0.203: v98.3,46.21 v98.3,19.42 | GPIO.33 64.89,15.47 v66.42,17
GPIO14  (via drill 0.33)
  Top 0.203: U1.51 96.93,46.7 v97.03,46.59
  Route2 0.203: v97.03,46.59 97.03,9.77 96.65,9.38 96.65,7.19 GPIO.8
GPIO15  (via drill 0.33)
  Top 0.203: U1.53 96.33,46.66 v96.14,46.47
  Route2 0.203: v96.14,46.47 96.14,11.54 94.11,9.51 94.11,7.19 GPIO.10
GPIO16  (via drill 0.33)
  Top 0.203: U1.57 95.13,46.72 v95.25,46.59 | v95.38,13.45 94.61,13.45 94.11,13.96 73.03,13.96 72.77,13.7 65.28,13.7 v63.88,12.3
  Route2 0.203: v95.25,46.59 95.25,30.97 95.63,30.59 95.63,13.7 v95.38,13.45 | GPIO.36 62.35,5.95 63.63,7.23 63.63,12.05 v63.88,12.3
GPIO17  (via drill 0.33)
  Top 0.203: U1.59 94.53,46.05 v94.61,45.96
  Route2 0.203: v94.61,45.96 94.61,30.59 94.11,30.09 94.11,11.29 92.84,10.02 92.84,8.48 GPIO.11
GPIO18  (via drill 0.33)
  Top 0.203: U1.63 93.33,46.74 v93.34,46.72
  Route2 0.203: v93.34,46.72 93.34,11.42 91.57,9.64 91.57,7.19 GPIO.12
GPIO19  (via drill 0.33)
  Top 0.203: U1.65 92.73,46.1 v92.71,46.09 | v92.71,13.07 92.08,13.07 91.69,13.45 73.28,13.45 73.03,13.19 66.04,13.19 64.26,11.42 v62.36,11.42
  Route2 0.203: v92.71,46.09 v92.71,13.07 | GPIO.35 62.35,11.41 v62.36,11.42
GPIO20  (via drill 0.33)
  Top 0.203: U1.69 91.53,46.89 v91.57,46.85 | GPIO.38 61.09,7.21 61.09,9.38 62.36,10.65 62.74,10.65 62.99,10.91 64.52,10.91 66.29,12.69 73.41,12.69 73.66,12.94 91.19,12.94 91.69,12.43 v91.82,12.43
  Route2 0.203: v91.57,46.85 91.57,39.61 92.2,38.98 92.2,13.45 91.82,13.07 v91.82,12.43
GPIO21  (via drill 0.33)
  Top 0.203: U1.71 90.93,46.97 v90.68,46.72 | v90.68,12.18 89.79,12.18 89.53,12.43 73.91,12.43 73.66,12.18 66.55,12.18 64.64,10.27 v64.26,10.27 | CAM1.P$11 39.8,4.76 v40.01,4.56
  Route2 0.203: v90.68,46.72 v90.68,12.18 | v58.67,10.27 58.55,10.15 58.55,7.23 57.27,5.95 GPIO.40 55.9,4.56 v40.01,4.56
  Bottom 0.203: v64.26,10.27 v58.67,10.27
GPIO22  (via drill 0.33)
  Top 0.203: U1.75 89.73,46.4 v89.79,46.34
  Route2 0.203: v89.79,46.34 89.79,10.51 GPIO.15
GPIO23  (via drill 0.33)
  Top 0.203: U1.77 89.13,46.88 v89.15,46.85 | v88.9,10.53 88.9,9.26 89.03,9.13 89.03,7.21 GPIO.16
  Route2 0.203: v89.15,46.85 89.15,10.78 v88.9,10.53
GPIO24  (via drill 0.33)
  Top 0.203: U1.81 87.93,46.64 v87.88,46.59
  Route2 0.203: v87.88,46.59 87.88,10.91 86.49,9.51 86.49,7.21 GPIO.18
GPIO25  (via drill 0.33)
  Top 0.203: v86.36,11.67 85.85,11.67 85.6,11.92 81.53,11.92 v81.41,11.8 | U1.83 87.33,47.18 87.25,47.1 v87.25,45.83
  Route2 0.203: v87.25,45.83 87.25,39.61 86.36,38.72 v86.36,11.67 | v81.41,11.8 81.41,7.21 GPIO.22
GPIO26  (via drill 0.33)
  Top 0.203: U1.87 86.13,46.95 v86.36,46.72 | v85.22,11.29 81.92,11.29 81.79,11.16 v66.55,11.16
  Route2 0.203: v86.36,46.72 86.36,39.61 85.72,38.98 85.72,11.8 v85.22,11.29 | v59.82,11.16 59.82,8.48 GPIO.37
  Bottom 0.203: v66.55,11.16 63.37,11.16 62.99,10.78 60.2,10.78 v59.82,11.16
GPIO27  (via drill 0.33)
  Top 0.203: U1.89 85.53,46.28 v85.6,46.21 | v84.07,10.53 87.63,10.53 88.39,11.29 90.04,11.29 90.3,11.04 90.3,8.48 GPIO.13
  Route2 0.203: v85.6,46.21 85.6,39.74 85.22,39.36 85.22,12.56 84.07,11.42 v84.07,10.53
GPIO28  (via drill 0.33)
  Top 0.203: U1.28 107.43,37.21 107.7,36.94 | 107.7,36.94 107.7,35.95 R4.1 | 107.7,36.94 107.7,37.07 v108.46,37.83 | CAM0.P$14 31.08,19.58 v31.11,19.54
  Top 0.305: R39.1 29.72,26.15 31.08,24.78 CAM0.P$14
  Route15 0.203: v108.46,37.83 106.05,37.83 105.03,36.82 104.14,36.82 103.63,37.32 101.47,37.32 99.19,35.04 99.19,24.37 98.42,23.61 75.18,23.61 72.64,21.07 36.45,21.07 34.54,19.16 31.5,19.16 31.43,19.23 v31.11,19.54
GPIO29  (via drill 0.33)
  Top 0.203: U1.30 106.83,37.98 105.59,36.75 R3.1 106.43,35.79 106.55,35.67 106.55,22.34 105.66,21.45 52.83,21.45 v51.31,22.97 | v33.15,24.5 32.47,24.5 32.08,24.88
  Top 0.305: R6.1 30.86,27.67 32.08,26.45 32.08,24.88 CAM0.P$13
  Route15 0.203: v51.31,22.97 44.7,22.97 44.45,22.72 34.92,22.72 v33.15,24.5
GPIO30  (via drill 0.33)
  Top 0.203: U1.34 105.63,39.06 v104.78,38.21 | CAM0.P$11 34.08,19.88 v34.16,19.8
  Route15 0.203: v104.78,38.21 101.09,38.21 98.42,35.55 98.42,24.88 97.92,24.37 74.8,24.37 72.39,21.96 36.32,21.96 34.73,20.37 v34.16,19.8
GPIO31  (via drill 0.33)
  Top 0.203: U1.36 105.03,39.48 v104.52,38.98 | CAM0.P$12 33.08,23.16 v33.15,23.23
  Route15 0.203: v104.52,38.98 101.22,38.98 98.04,35.8 98.04,25.13 97.66,24.75 74.55,24.75 72.14,22.34 34.04,22.34 33.53,22.85 v33.15,23.23
GPIO36  (via drill 0.33)
  Top 0.203: v52.83,28.94 53.98,28.94 55.63,30.59 60.2,30.59 60.83,31.23 88.01,31.23 88.9,30.34 93.34,30.34 94.83,31.82 U1.58
  Route2 0.203: 51.36,47.94 52.7,46.59 52.7,29.07 v52.83,28.94
GPIO37  (via drill 0.33)
  Top 0.203: v53.98,31.1 59.94,31.1 60.58,31.74 88.27,31.74 89.15,30.85 92.96,30.85 94.23,32.11 U1.60
  Route2 0.203: v53.98,31.1 53.9,31.18 53.9,36.76 53.34,37.32 53.34,51.04 53.85,51.55 53.85,61.43
GPIO38  (via drill 0.33)
  Top 0.203: v56.52,31.86 59.94,31.86 60.33,32.24 88.52,32.24 89.41,31.35 92.46,31.35 93.03,31.93 U1.64
  Route2 0.203: 56.44,31.94 v56.52,31.86
GPIO39  (via drill 0.33)
  Top 0.203: v59.05,32.75 88.77,32.75 89.66,31.86 91.95,31.86 92.43,32.34 U1.66
  Route2 0.203: v59.05,32.75 58.98,32.83 v58.98,54.16
  Route15 0.203: v58.98,54.16 58.55,54.6 58.55,59.04 58.98,59.47
GPIO40  (via drill 0.33)
  Top 0.305: U1.70 91.23,38.55 v91.57,38.21
  Bottom 0.305: v91.57,38.21 91.57,33.01 v94.87,29.7
GPIO41
  Top 0.203: U1.72 90.63,35.52
GPIO42  (via drill 0.33)
  Top 0.203: U1.76 89.43,37.34 88.77,36.69 73.79,36.69 71.37,34.28 65.66,34.28 64.9,33.51 53.85,33.51 52.96,34.4 52.96,36.44 52.7,36.69 v38.73,36.69
  Route2 0.203: 38.66,36.76 v38.73,36.69
GPIO43  (via drill 0.33)
  Top 0.203: 38.99,37.83 39.62,37.2 52.96,37.2 53.47,36.69 53.47,34.66 54.1,34.02 64.64,34.02 65.41,34.78 71.25,34.78 73.66,37.2 88.27,37.2 88.83,37.76 U1.78
  Top 0.254: 38.99,37.83 38.99,38.47 v34.42,43.04
  Route2 0.254: v34.42,43.04 34.42,58.41 33.58,59.24
GPIO44  (via drill 0.33)
  Top 0.203: U1.82 87.63,42.27 v88.52,43.17 | v100.84,43.17 100.84,38.21 100.46,37.83 98.38,37.83 R5.1
  Bottom 0.203: v88.52,43.17 v100.84,43.17
GPIO45  (via drill 0.33)
  Top 0.305: U1.84 87.03,38.44 v87.12,38.34 | v87.12,26.66 85.66,26.66
  Bottom 0.305: v87.12,38.34 v87.12,30.09 v87.12,26.66
GPIO46
  Top 0.254: U1.88 85.83,38.44 85.09,37.7 73.28,37.7 70.99,35.42 65.28,35.42 64.39,34.53 55.37,34.53 54.48,35.42 54.48,36.82 52.7,38.59 45.21,38.59
N$1
  Top 0.254: R36.1 125.22,54.98 122.87,52.62 PWR.A
N$6  (via drill 0.33)
  Top 0.203: 123.69,47.98 R2.1
  Top 0.254: U1.90 85.23,43.03 v84.45,43.8 | v127.13,47.99 123.67,47.99 R2.1
  Bottom 0.254: v84.45,43.8 101.73,43.8 103.12,42.4 123.95,42.4 125.98,40.37 127.13,40.37 127.51,40.75 127.51,47.61 v127.13,47.99
N$7  (via drill 0.33)
  Top 0.203: 117.94,57.4 v117.94,64.22
  Top 0.254: 117.94,57.4 R25.2
  Route2 0.203: ETHERNET.12 103.86,81.55 104.52,80.89 108.58,80.89 116.84,72.63 116.84,65.31 v117.94,64.22
N$8  (via drill 0.33)
  Top 0.254: R26.2 115.78,61.53 v116.71,62.47
  Bottom 0.203: ETHERNET.9 117.12,81.49 120.27,78.34 120.27,64.12 118.62,62.47 v116.71,62.47
N$9
  Top 0.203: IC6.28 83.43,59.41 83.31,59.3 83.31,58.53 83.06,58.28 82.33,58.28 R20.1
N$11  (via drill 0.33)
  Top 0.203: IC6.63 93.25,64.41 v94.36,65.52
  Top 0.254: v97.79,79.36 98.04,79.36 98.55,79.87 99.63,79.87 R9.2
  Bottom 0.203: v94.36,65.52 94.36,69.45 97.16,72.25 97.16,78.73 v97.79,79.36
N$17
  Top 0.152: R27.2 C26.1
  Top 0.254: R27.2 114.3,81.27 112.4,79.37 112.4,75.94 109.86,73.39 ETHERNET.5
  Bottom 0.254: ETHERNET.4 111.13,70.6 ETHERNET.5
N$40  (via drill 0.33)
  Top 0.203: IC6.62 93.52,63.91 94.36,64.76 94.74,64.76 96.14,66.15 | 96.14,66.15 C42.2 | v96.65,66.92 96.65,66.66 96.14,66.15
  Top 0.406: v98.42,51.17 93.85,51.17 92.77,52.25 FB2.2
  Route15 0.406: v98.42,51.17 99.06,51.8 99.06,64.5 v96.65,66.92
N$42
  Top 0.203: IC6.41 88.76,55.73 88.01,54.98 88.01,54.18 R32.1
N$43
  Top 0.203: IC6.50 93.46,57.91 93.85,57.52 93.85,55.99 94.74,55.1 94.74,54.6 95.25,54.09 R33.1
NLNKA_LED  (via drill 0.33)
  Top 0.203: IC6.21 83.51,62.91 v83.31,63.11
  Bottom 0.203: v83.31,63.11 83.82,63.61 96.01,63.61 100.2,67.8 103,67.8 104.78,69.58 104.78,71.61 110.62,77.46 110.62,77.71 114.58,81.67 ETHERNET.10
NSPD_LED  (via drill 0.33)
  Top 0.203: IC6.22 82.86,62.41 v82.42,62.85 | ETHERNET.11 106.4,81.8 107.44,80.76 107.44,75.3 v104.27,72.12
  Bottom 0.203: v82.42,62.85 82.42,63.49 83.06,64.12 95.5,64.12 99.82,68.44 103,68.44 104.27,69.71 v104.27,72.12
RX_N
  Top 0.203: IC6.53 104.66,59.41 105.05,59.8 105.05,60.64 arc-90 105.7,61.29 106.4,61.29 arc90 106.69,61.58 106.69,61.59 arc90 106.4,61.88 104.07,61.88 arc-90 103.42,62.53 103.42,62.54 arc-90 104.07,63.19 106.4,63.19 arc90 106.69,63.48 106.69,63.49 arc90 106.4,63.78 105.7,63.78 arc-90 105.05,64.43 105.05,67.52 105.56,68.03 | 105.56,68.03 108.31,68.03 108.58,68.31 ETHERNET.6 | 105.56,68.03 100.26,73.33 100.26,74.94 R28.2 C24.1
RX_P
  Top 0.203: IC6.52 104.67,58.91 105.41,59.65 105.41,60.64 arc-90 105.7,60.93 106.4,60.93 arc90 107.05,61.58 107.05,61.59 arc90 106.4,62.24 arc-90 106.11,62.53 106.11,62.54 arc-90 106.4,62.83 arc90 107.05,63.48 107.05,63.49 arc90 106.4,64.14 105.7,64.14 arc-90 105.41,64.43 105.41,67.38 105.71,67.68 108.2,67.68 | 108.2,67.68 109.09,67.68 | 109.09,67.68 109.86,68.44 109.86,70.09 110.36,70.6 111.13,70.6 ETHERNET.3 | C23.1 107.95,67.42 108.2,67.68 | R29.2 109.47,67.3 109.09,67.68
TX_N  (via drill 0.33)
  Top 0.203: IC6.56 96.41,60.91 96.85,61.35 102.21,61.35 102.49,61.63 v102.37,61.75 | 121.32,68.95 120.27,68.95 119.89,69.33 ETHERNET.2 | 121.32,68.95 C22.1 | 121.32,68.95 121.32,67.4 R30.2
  Bottom 0.203: v102.37,61.75 102.49,61.63 102.69,61.83 102.69,65.21 104.19,66.71 106.05,66.71 arc-90 106.69,66.06 arc90 106.98,65.77 107.33,65.77 arc90 107.62,66.06 107.62,67.36 arc-90 107.91,67.65 108.25,67.65 arc-90 108.55,67.36 108.55,66.06 arc90 108.84,65.77 109.18,65.77 arc90 109.47,66.06 arc-90 110.12,66.71 112.19,66.71 113.67,68.19 ETHERNET.2
TX_P  (via drill 0.33)
  Top 0.203: IC6.55 96.41,60.41 97,61 102.36,61 102.74,61.38 v102.86,61.26 | ETHERNET.1 118.87,71.87 121.28,74.28 C21.1 R31.2
  Bottom 0.203: v102.86,61.26 102.74,61.38 103.05,61.69 103.05,65.06 104.34,66.36 106.05,66.36 arc-90 106.34,66.06 arc90 106.98,65.42 109.18,65.42 arc90 109.83,66.06 arc-90 110.12,66.36 112.34,66.36 113.92,67.93 114.43,67.93 114.94,68.44 ETHERNET.1
USBD2_N
  Top 0.254: IC6.1 92.26,70.7 90.64,72.33 88.86,72.33 88.34,72.84 88.34,73.27 89.16,74.08 USB.2-2
USBD2_P
  Top 0.254: IC6.2 91.76,70.62 90.47,71.92 88.69,71.92 87.94,72.67 87.94,73.27 87.3,73.9 USB.2-3
USBD3_N
  Top 0.254: IC6.3 91.26,66.47 90.37,67.36 90.37,70.76 89.64,71.49 87.78,71.49 arc-90 87.47,71.81 arc90 86.74,72.53 86.59,72.53 arc90 85.87,71.81 85.87,71.28 arc-90 85.55,70.96 85.4,70.96 arc-90 85.08,71.28 85.08,71.81 arc90 84.35,72.53 84.2,72.53 arc90 83.48,71.81 arc-90 83.16,71.49 79.92,71.49 78.77,72.64 78.77,75.29 79.84,76.36 82.49,76.36 83.66,75.19 87.8,75.19 USB.1-2
USBD3_P
  Top 0.254: IC6.4 90.76,66.39 89.97,67.19 89.97,70.59 89.48,71.08 87.78,71.08 arc-90 87.06,71.81 arc90 86.74,72.12 86.59,72.12 arc90 86.27,71.81 86.27,70.76 arc-90 85.55,70.04 85.4,70.04 arc-90 84.67,70.76 84.67,71.81 arc90 84.35,72.12 84.2,72.12 arc90 83.88,71.81 arc-90 83.16,71.08 79.75,71.08 78.36,72.47 78.36,75.46 79.67,76.77 82.66,76.77 83.83,75.6 87.07,75.6 87.3,75.83 USB.1-3
USBD_N  (via drill 0.3, 0.33)  (1 unrouted)
  Top 0.203: U1.167 62.13,49.87 62.15,49.9 v62.03,49.95 | v62.03,54.22 62.15,54.22 62.15,55.41 62.24,55.49 | IC6.58 94.31,61.91 94.94,62.55 96.34,62.55 v96.19,62.39 | v72.01,54.98 71.93,54.9 71.93,51.6 70.43,50.1 63.42,50.1 62.74,50.79
  Bottom 0.203: v62.03,49.95 62.15,49.9 62.15,54.22 v62.03,54.22 | v96.19,62.39 96.34,62.55 96.34,60.51 95.05,59.22 94.54,59.22 92.25,56.93 73.97,56.93 v72.01,54.98
USBD_P  (via drill 0.3, 0.33)  (1 unrouted)
  Top 0.203: U1.165 62.73,49.73 62.56,49.9 v62.69,49.95 | v62.69,54.22 62.56,54.22 62.56,54.8 62.74,54.98 | IC6.59 94.3,62.41 94.8,62.9 96.7,62.9 v96.81,63.01 | v71.3,54.22 71.58,53.94 71.58,51.75 70.28,50.46 63.58,50.46 63.24,50.79
  Bottom 0.203: v62.69,49.95 62.56,49.9 62.56,54.22 v62.69,54.22 | v96.81,63.01 96.7,62.9 96.7,60.36 95.2,58.86 94.69,58.86 92.4,56.58 74.11,56.58 72.77,55.23 72.77,54.98 72.01,54.22 v71.3,54.22
VDD18CORE  (via drill 0.6)
  Top 0.203: IC6.15 85.26,66.74 84.84,67.17 C40.2 | C39.2 84.84,54.34 v86.11,55.61 86.87,55.61 87.26,56.01 IC6.38 | 80.76,65.14 C41.2
  Top 0.406: C40.2 81.23,67.05 81.23,66.48 80.64,65.9 C41.2 | 80.76,65.14 v83.06,65.14
  Route15 0.406: v86.11,55.61 86.11,64.29 85.26,65.14 v83.06,65.14
VDD18PLL
  Top 0.254: IC6.48 92.26,55.68 92.58,55.36 92.58,54.28 FB2.1 92.39,54.47 91.57,54.47 91.15,54.05 C43.2
XI
  Top 0.203: IC6.61 93.9,63.41 94.74,64.25 95.63,64.25 97.41,66.03 97.41,66.81 Q6.1 98.63,68.03 98.63,68.64 | R13.2 102.29,67.65 100.84,69.1 98.98,69.1 98.63,68.74 98.63,68.64 | C45.2 98.46,68.81 98.63,68.64
XO
  Top 0.203: 100.11,65.26 Q6.3 101.03,64.9 R13.1 | 100.11,65.26 100.11,63.16 C44.2 | IC6.60 94.04,62.91 94.49,63.36 96.01,63.36 96.9,64.25 99.1,64.25 100.11,65.26

### Text on the board
tNames: * | V1.2 | Compute module | 6-12V | 5V | GND
200bmp: C:/Users/hasseb/Dropbox/projektit/common/pics/positive_polarity.bmp